# EAGLE schematic AQ_sensor_GSM (EAGLE 9.6.2)

## Sheet 1 of 8: Control Board
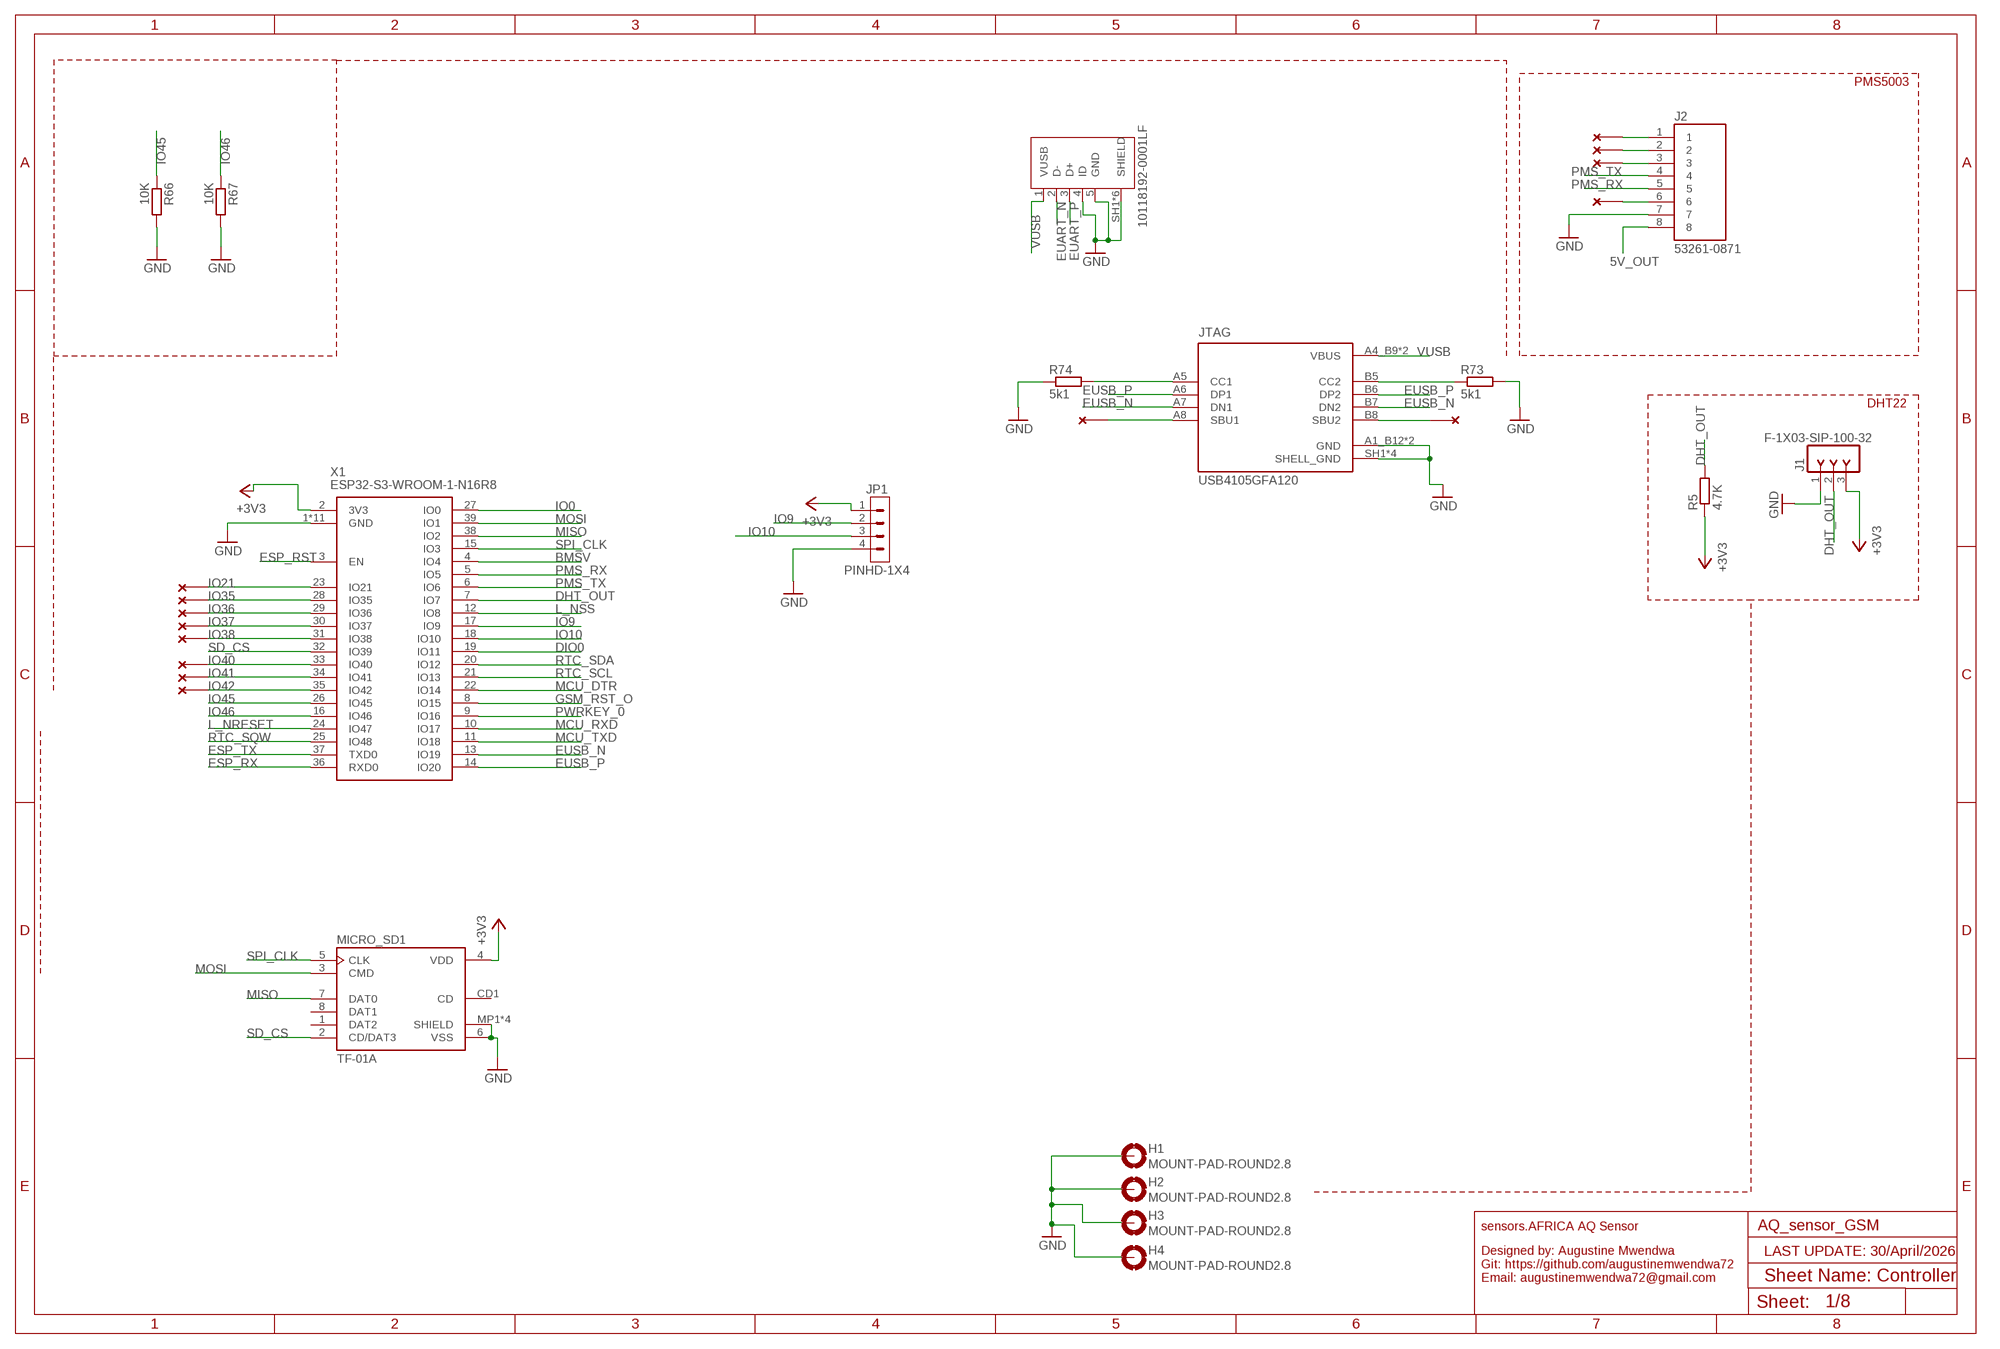
[diagram p0: schematic, sheet 1]

### Parts
ESP_UART  10118192-0001LF  [AMPHENOL_10118192-0001LF]
H1  MOUNT-PAD-ROUND2.8  [2,8-PAD]
H2  MOUNT-PAD-ROUND2.8  [2,8-PAD]
H3  MOUNT-PAD-ROUND2.8  [2,8-PAD]
H4  MOUNT-PAD-ROUND2.8  [2,8-PAD]
J1  F-1X03-SIP-100-32  [SIP-100-03-32]
J2  53261-0871  [MOLEX_53261-0871]
JP1  PINHD-1X4  [1X04]
JTAG  USB4105GFA120  [GCT_USB4105GFA120]
MICRO_SD1  TF-01A  [TF-01A]
R5  4.7K  R-EU_R0603  [R0603]
R66  10K  R-EU_R0603  [R0603]
R67  10K  R-EU_R0603  [R0603]
R73  5k1  R-EU_R0603  [R0603]
R74  5k1  R-EU_R0603  [R0603]
U$87  NC_MARKER  (no package)
U$88  NC_MARKER  (no package)
U$89  NC_MARKER  (no package)
U$90  NC_MARKER  (no package)
U$91  NC_MARKER  (no package)
U$92  NC_MARKER  (no package)
U$93  NC_MARKER  (no package)
U$94  NC_MARKER  (no package)
U$100  NC_MARKER  (no package)
U$101  NC_MARKER  (no package)
U$102  NC_MARKER  (no package)
U$103  NC_MARKER  (no package)
U$104  NC_MARKER  (no package)
U$105  NC_MARKER  (no package)
X1  ESP32-S3-WROOM-1-N16R8  [ESP32S3WROOM1N8R2]

### Nets
5V_OUT [HCurrent]: J2.8 ; also sheet 3,4,6,8
+3V3 [POWER]: J1.3 JP1.1 MICRO_SD1.4(VDD) R5.1 X1.2(3V3) ; also sheet 2,4,6,7
BMSV [HCurrent]: X1.4(IO4) ; also sheet 4
DHT_OUT: J1.2 R5.2 X1.7(IO7)
DIO0: X1.19(IO11) ; also sheet 7
ESP_RST: X1.3(EN) ; also sheet 6
ESP_RX: X1.36(RXD0) ; also sheet 6
ESP_TX: X1.37(TXD0) ; also sheet 6
EUART_N: ESP_UART.2(D-) ; also sheet 6
EUART_P: ESP_UART.3(D+) ; also sheet 6
EUSB_N: JTAG.A7(DN1) JTAG.B7(DN2) X1.13(IO19) ; also sheet 6
EUSB_P: JTAG.A6(DP1) JTAG.B6(DP2) X1.14(IO20) ; also sheet 6
GND: ESP_UART.4(ID) ESP_UART.5(GND) ESP_UART.SH1(SHIELD) ESP_UART.SH2(SHIELD) ESP_UART.SH3(SHIELD) ESP_UART.SH4(SHIELD) ESP_UART.SH5(SHIELD) ESP_UART.SH6(SHIELD) H1.B2,8(MOUNT) H2.B2,8(MOUNT) H3.B2,8(MOUNT) H4.B2,8(MOUNT) J1.1 J2.7 JP1.4 JTAG.A1_B12(GND) JTAG.B1_A12(GND) JTAG.SH1(SHELL_GND) JTAG.SH2(SHELL_GND) JTAG.SH3(SHELL_GND) JTAG.SH4(SHELL_GND) MICRO_SD1.6(VSS) MICRO_SD1.MP1(SHIELD) MICRO_SD1.MP2(SHIELD) MICRO_SD1.MP3(SHIELD) MICRO_SD1.MP4(SHIELD) R66.2 R67.2 R73.2 R74.1 X1.1(GND) X1.40(GND) X1.41(GND) X1.42(GND) X1.43(GND) X1.44(GND) X1.45(GND) X1.46(GND) X1.47(GND) X1.48(GND) X1.49(GND) ; also sheet 2,3,4,5,6,7
GSM_RST_O: X1.8(IO15) ; also sheet 5
IO0: X1.27(IO0) ; also sheet 6
IO9: JP1.2 X1.17(IO9)
IO10: JP1.3 X1.18(IO10)
IO21: U$87.P$1 X1.23(IO21)
IO35: U$88.P$1 X1.28(IO35)
IO36: U$89.P$1 X1.29(IO36)
IO37: U$90.P$1 X1.30(IO37)
IO38: U$91.P$1 X1.31(IO38)
IO40: U$92.P$1 X1.33(IO40)
IO41: U$93.P$1 X1.34(IO41)
IO42: U$94.P$1 X1.35(IO42)
IO45: R66.1 X1.26(IO45)
IO46: R67.1 X1.16(IO46)
L_NRESET: X1.24(IO47) ; also sheet 7
L_NSS: X1.12(IO8) ; also sheet 7
MCU_DTR: X1.22(IO14) ; also sheet 2
MCU_RXD: X1.10(IO17) ; also sheet 2
MCU_TXD: X1.11(IO18) ; also sheet 2
MISO: MICRO_SD1.7(DAT0) X1.38(IO2) ; also sheet 7
MOSI: MICRO_SD1.3(CMD) X1.39(IO1) ; also sheet 7
N$12: JTAG.A5(CC1) R74.2
N$139: JTAG.A8(SBU1) U$100.P$1
N$140: J2.1 U$103.P$1
N$141: JTAG.B8(SBU2) U$101.P$1
N$144: JTAG.B5(CC2) R73.1
N$153: J2.2 U$102.P$1
N$154: J2.3 U$104.P$1
N$155: J2.6 U$105.P$1
PMS_RX: J2.5 X1.5(IO5)
PMS_TX: J2.4 X1.6(IO6)
PWRKEY_0: X1.9(IO16) ; also sheet 5
RTC_SCL: X1.21(IO13) ; also sheet 8
RTC_SDA: X1.20(IO12) ; also sheet 8
RTC_SQW: X1.25(IO48) ; also sheet 8
SD_CS: MICRO_SD1.2(CD/DAT3) X1.32(IO39)
SPI_CLK: MICRO_SD1.5(CLK) X1.15(IO3) ; also sheet 7
VUSB [HCurrent]: ESP_UART.1(VUSB) JTAG.A4_B9(VBUS) JTAG.B4_A9(VBUS) ; also sheet 4,6
Unconnected: MICRO_SD1.1(DAT2) MICRO_SD1.8(DAT1) MICRO_SD1.CD1(CD)

### Notes on the sheet
- PMS5003
- DHT22
- sensors.AFRICA AQ Sensor
- LAST UPDATE: 30/April/2026
- Designed by: Augustine Mwendwa
  Git: https://github.com/augustinemwendwa72
  Email: augustinemwendwa72@gmail.com
- Sheet Name: Controller

## Sheet 2 of 8: Logic Level Converter
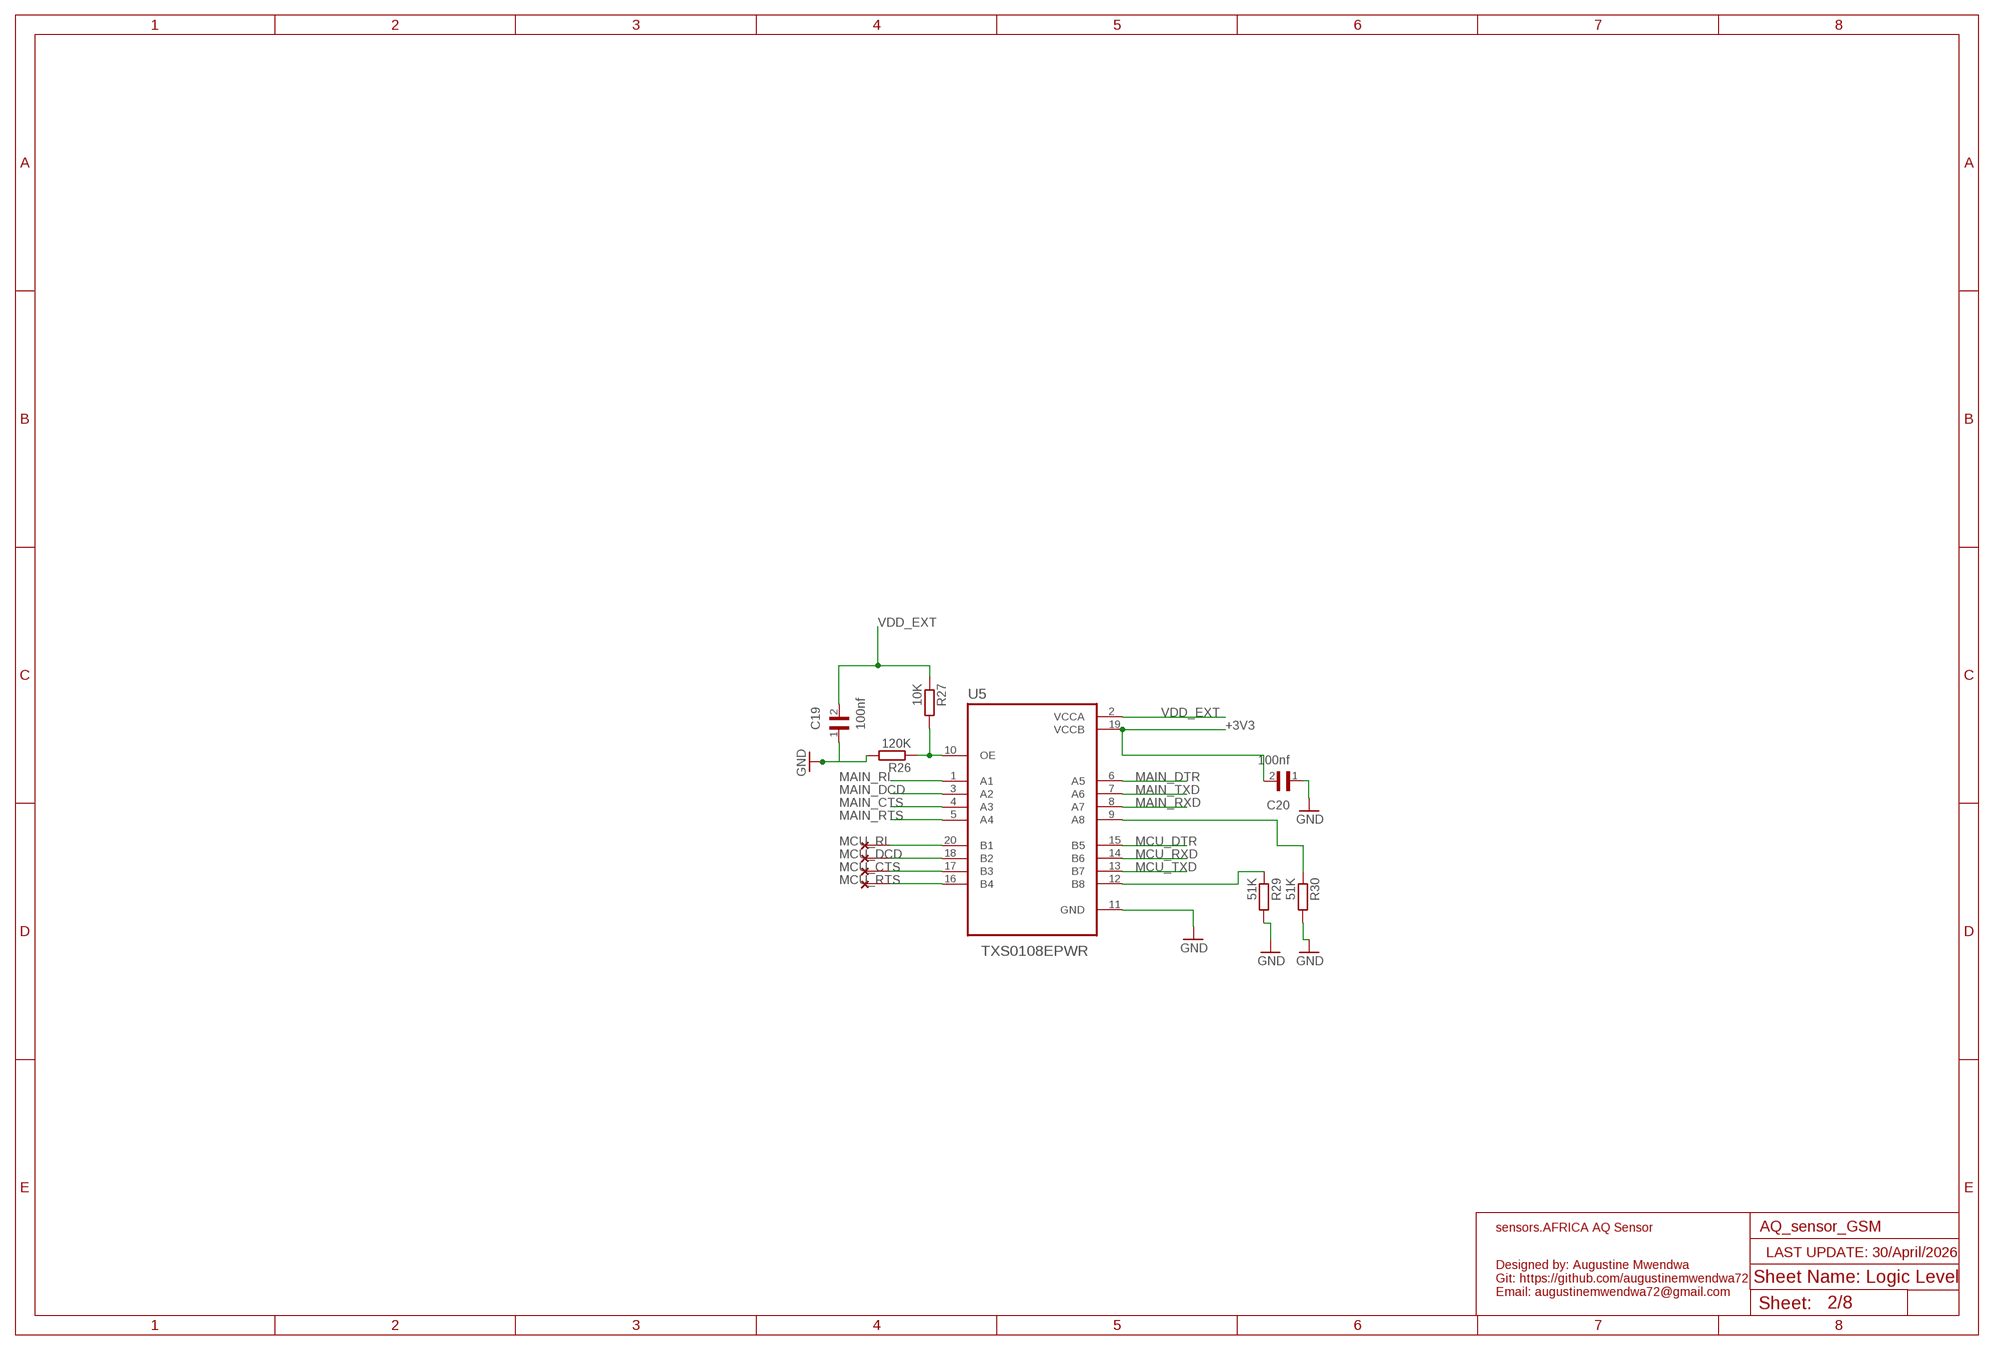
[diagram p1: schematic, sheet 2]

### Parts
C19  100nf  06035C104K4T2A  [CAPC1608X90N]
C20  100nf  06035C104K4T2A  [CAPC1608X90N]
R26  120K  R-EU_R0603  [R0603]
R27  10K  R-EU_R0603  [R0603]
R29  51K  R-EU_R0603  [R0603]
R30  51K  R-EU_R0603  [R0603]
U5  TXS0108EPWR  [SOP65P640X120-20N]
U$85  NC_MARKER  (no package)
U$96  NC_MARKER  (no package)
U$97  NC_MARKER  (no package)
U$98  NC_MARKER  (no package)

### Nets
+3V3 [POWER]: C20.2 U5.19(VCCB) ; also sheet 1,4,6,7
GND: C19.1 C20.1 R26.2 R29.2 R30.2 U5.11(GND) ; also sheet 1,3,4,5,6,7
MAIN_CTS: U5.4(A3) ; also sheet 3
MAIN_DCD: U5.3(A2) ; also sheet 3
MAIN_DTR: U5.6(A5) ; also sheet 3
MAIN_RI [BGA]: U5.1(A1) ; also sheet 3,5
MAIN_RTS: U5.5(A4) ; also sheet 3
MAIN_RXD: U5.8(A7) ; also sheet 3
MAIN_TXD: U5.7(A6) ; also sheet 3
MCU_CTS: U5.17(B3) U$97.P$1
MCU_DCD: U5.18(B2) U$96.P$1
MCU_DTR: U5.15(B5) ; also sheet 1
MCU_RI: U5.20(B1) U$85.P$1
MCU_RTS: U5.16(B4) U$98.P$1
MCU_RXD: U5.14(B6) ; also sheet 1
MCU_TXD: U5.13(B7) ; also sheet 1
N$31: R26.1 R27.2 U5.10(OE)
N$40: R30.1 U5.9(A8)
N$41: R29.1 U5.12(B8)
VDD_EXT: C19.2 R27.1 U5.2(VCCA) ; also sheet 3

### Notes on the sheet
- sensors.AFRICA AQ Sensor
- LAST UPDATE: 30/April/2026
- Sheet Name: Logic Level
- Designed by: Augustine Mwendwa
  Git: https://github.com/augustinemwendwa72
  Email: augustinemwendwa72@gmail.com

## Sheet 3 of 8: GSM
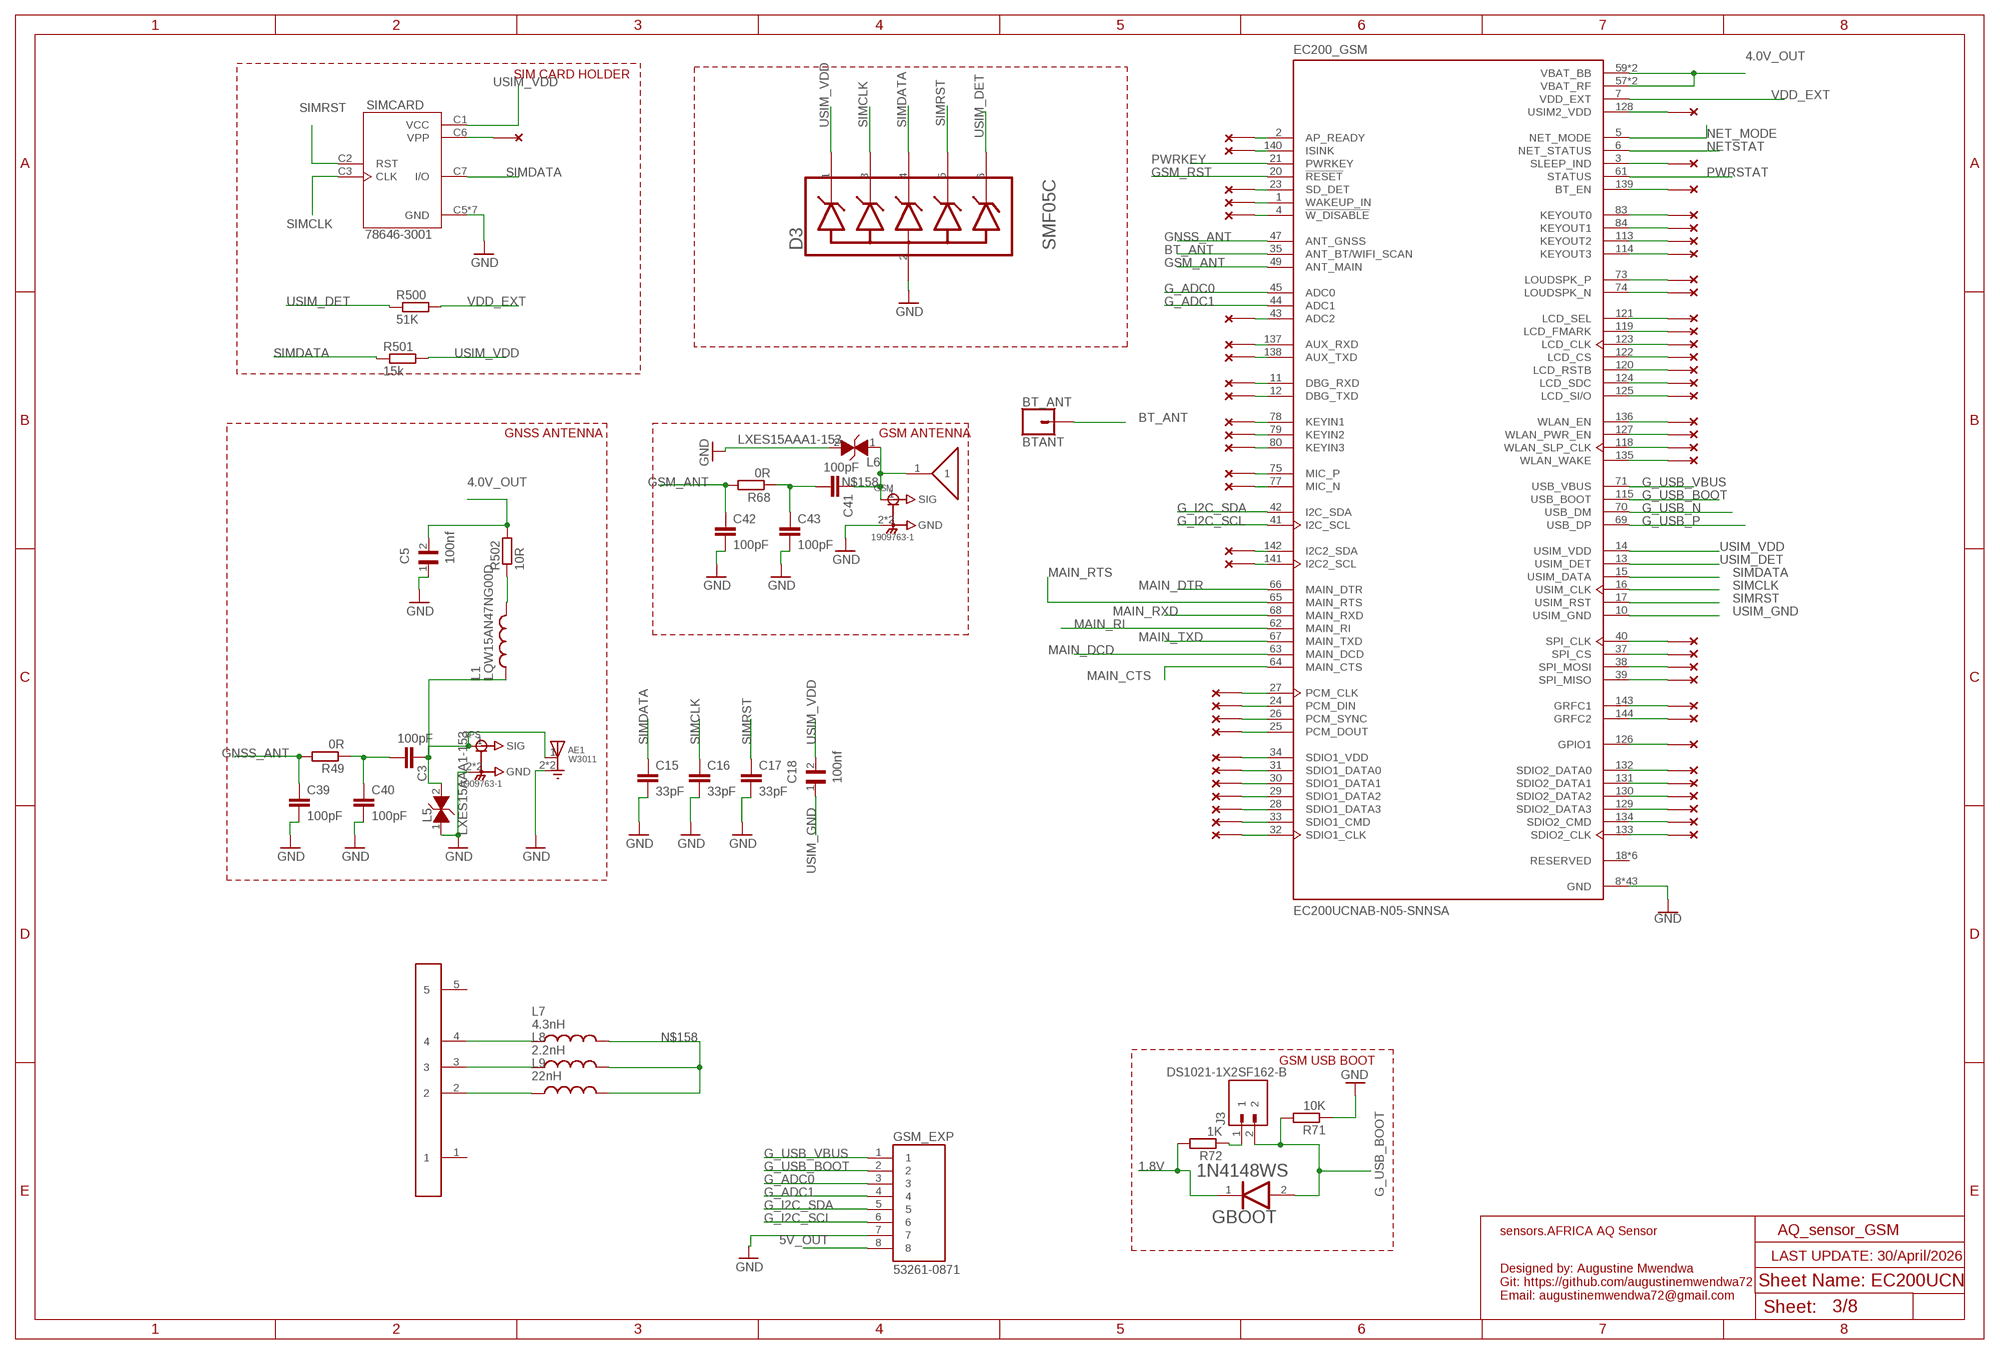
[diagram p2: schematic, sheet 3]

### Parts
AE1  W3011  [XDCR_W3011]
BT_ANT  BTANT  CONN_01  [1X01]
C3  100pF  100PF-0603-50V-5%  [0603]
C5  100nf  06035C104K4T2A  [CAPC1608X90N]
C15  33pF  C-EUC0603  [C0603]
C16  33pF  C-EUC0603  [C0603]
C17  33pF  C-EUC0603  [C0603]
C18  100nf  06035C104K4T2A  [CAPC1608X90N]
C39  100pF  100PF-0603-50V-5%  [0603]
C40  100pF  100PF-0603-50V-5%  [0603]
C41  100pF  100PF-0603-50V-5%  [0603]
C42  100pF  100PF-0603-50V-5%  [0603]
C43  100pF  100PF-0603-50V-5%  [0603]
D3  SEMTECH_SMF05CSEMTECH_SMF05C_0_0  [SEMTECH_SMF05C_0]
EC200_GSM  EC200UCNAB-N05-SNNSA  [XCVR_EC200UCNAB-N05-SNNSA]
GBOOT  ON_SEMI_1N4148WSON_SEMI_1N4148WS_0_0  [ON_SEMI_1N4148WS_0]
GPS  1909763-1  [TE_1909763-1]
GSM  1909763-1  [TE_1909763-1]
GSM_EXP  53261-0871  [MOLEX_53261-0871]
J3  DS1021-1X2SF162-B  [CONNFLY_DS1021-1X2SF162-B]
L1  LQW15AN47NG00D  [INDC1005X60N]
L5  LXES15AAA1-153  [INDC1005X45]
L6  LXES15AAA1-153  [INDC1005X45]
L7  4.3nH  LQW15AN47NG00D  [INDC1005X60N]
L8  2.2nH  LQW15AN47NG00D  [INDC1005X60N]
L9  22nH  LQW15AN47NG00D  [INDC1005X60N]
R49  0R  R-EU_R0603  [R0603]
R68  0R  R-EU_R0603  [R0603]
R71  10K  R-EU_R0603  [R0603]
R72  1K  R-EU_R0603  [R0603]
R500  51K  R-EU_R0603  [R0603]
R501  15k  R-EU_R0603  [R0603]
R502  10R  R-EU_R0603  [R0603]
SIMCARD  78646-3001  [MOLEX_78646-3001]
U$2  NC_MARKER  (no package)
U$3  NC_MARKER  (no package)
U$4  NC_MARKER  (no package)
U$5  NC_MARKER  (no package)
U$6  NC_MARKER  (no package)
U$7  NC_MARKER  (no package)
U$8  NC_MARKER  (no package)
U$9  NC_MARKER  (no package)
U$10  NC_MARKER  (no package)
U$11  NC_MARKER  (no package)
U$12  NC_MARKER  (no package)
U$13  NC_MARKER  (no package)
U$14  NC_MARKER  (no package)
U$15  NC_MARKER  (no package)
U$16  NC_MARKER  (no package)
U$17  NC_MARKER  (no package)
U$18  NC_MARKER  (no package)
U$19  NC_MARKER  (no package)
U$20  NC_MARKER  (no package)
U$21  NC_MARKER  (no package)
U$22  NC_MARKER  (no package)
U$23  NC_MARKER  (no package)
U$24  NC_MARKER  (no package)
U$25  NC_MARKER  (no package)
U$26  NC_MARKER  (no package)
U$27  NC_MARKER  (no package)
U$28  NC_MARKER  (no package)
U$29  NC_MARKER  (no package)
U$30  NC_MARKER  (no package)
U$31  NC_MARKER  (no package)
U$32  NC_MARKER  (no package)
U$33  NC_MARKER  (no package)
U$34  NC_MARKER  (no package)
U$35  NC_MARKER  (no package)
U$36  NC_MARKER  (no package)
U$37  NC_MARKER  (no package)
U$38  NC_MARKER  (no package)
U$39  NC_MARKER  (no package)
U$40  NC_MARKER  (no package)
U$41  NC_MARKER  (no package)
U$42  NC_MARKER  (no package)
U$43  NC_MARKER  (no package)
U$44  NC_MARKER  (no package)
U$45  NC_MARKER  (no package)
U$46  NC_MARKER  (no package)
U$47  NC_MARKER  (no package)
U$48  NC_MARKER  (no package)
U$49  NC_MARKER  (no package)
U$50  NC_MARKER  (no package)
U$51  NC_MARKER  (no package)
U$52  NC_MARKER  (no package)
U$53  NC_MARKER  (no package)
U$54  NC_MARKER  (no package)
U$55  NC_MARKER  (no package)
U$56  NC_MARKER  (no package)
U$57  NC_MARKER  (no package)
U$58  NC_MARKER  (no package)
U$75  NC_MARKER  (no package)
U$81  NC_MARKER  (no package)
U$82  NC_MARKER  (no package)
U$83  NC_MARKER  (no package)
U$84  NC_MARKER  (no package)
U$107  GSM_SPRING_ANTENNA  [GSM_SPRING_ANTENNA]
U$109  ADCH002_V1  [ADCH002_V1]

### Nets
1.8V: GBOOT.1(CATHODE) R72.2 ; also sheet 4
4.0V_OUT [HCurrent]: C5.2 EC200_GSM.57(VBAT_RF) EC200_GSM.58(VBAT_RF) EC200_GSM.59(VBAT_BB) EC200_GSM.60(VBAT_BB) R502.2 ; also sheet 4,5
5V_OUT [HCurrent]: GSM_EXP.8 ; also sheet 1,4,6,8
BT_ANT [Antenna]: BT_ANT.1 EC200_GSM.35(ANT_BT/WIFI_SCAN)
G_ADC0: EC200_GSM.45(ADC0) GSM_EXP.3
G_ADC1: EC200_GSM.44(ADC1) GSM_EXP.4
G_I2C_SCL: EC200_GSM.41(I2C_SCL) GSM_EXP.6
G_I2C_SDA: EC200_GSM.42(I2C_SDA) GSM_EXP.5
G_USB_BOOT: EC200_GSM.115(USB_BOOT) GBOOT.2(ANODE) GSM_EXP.2 J3.2 R71.2
G_USB_N: EC200_GSM.70(USB_DM) ; also sheet 4,6
G_USB_P: EC200_GSM.69(USB_DP) ; also sheet 4,6
G_USB_VBUS: EC200_GSM.71(USB_VBUS) GSM_EXP.1
GND: AE1.2(GND) AE1.3(GND) C5.1 C15.2 C16.2 C17.2 C39.2 C40.2 C42.2 C43.2 D3.2(ANODE) EC200_GSM.8(GND) EC200_GSM.9(GND) EC200_GSM.19(GND) EC200_GSM.22(GND) EC200_GSM.36(GND) EC200_GSM.46(GND) EC200_GSM.48(GND) EC200_GSM.50(GND) EC200_GSM.51(GND) EC200_GSM.52(GND) EC200_GSM.53(GND) EC200_GSM.54(GND) EC200_GSM.56(GND) EC200_GSM.72(GND) EC200_GSM.76(GND) EC200_GSM.85(GND) EC200_GSM.86(GND) EC200_GSM.87(GND) EC200_GSM.88(GND) EC200_GSM.89(GND) EC200_GSM.90(GND) EC200_GSM.91(GND) EC200_GSM.92(GND) EC200_GSM.93(GND) EC200_GSM.94(GND) EC200_GSM.95(GND) EC200_GSM.96(GND) EC200_GSM.97(GND) EC200_GSM.98(GND) EC200_GSM.99(GND) EC200_GSM.100(GND) EC200_GSM.101(GND) EC200_GSM.102(GND) EC200_GSM.103(GND) EC200_GSM.104(GND) EC200_GSM.105(GND) EC200_GSM.106(GND) EC200_GSM.107(GND) EC200_GSM.108(GND) EC200_GSM.109(GND) EC200_GSM.110(GND) EC200_GSM.111(GND) EC200_GSM.112(GND) GPS.2(GND) GPS.3(GND) GSM.2(GND) GSM.3(GND) GSM_EXP.7 L5.1 L6.2 R71.1 SIMCARD.C5(GND) SIMCARD.G1(GND) SIMCARD.G2(GND) SIMCARD.G3(GND) SIMCARD.G4(GND) SIMCARD.G5(GND) SIMCARD.G6(GND) ; also sheet 1,2,4,5,6,7
GNSS_ANT [Antenna]: C39.1 EC200_GSM.47(ANT_GNSS) R49.2
GSM_ANT [Antenna]: C42.1 EC200_GSM.49(ANT_MAIN) R68.2
GSM_RST [BGA]: EC200_GSM.20(!RESET) ; also sheet 5
MAIN_CTS: EC200_GSM.64(MAIN_CTS) ; also sheet 2
MAIN_DCD: EC200_GSM.63(MAIN_DCD) ; also sheet 2
MAIN_DTR: EC200_GSM.66(MAIN_DTR) ; also sheet 2
MAIN_RI [BGA]: EC200_GSM.62(MAIN_RI) ; also sheet 2,5
MAIN_RTS: EC200_GSM.65(MAIN_RTS) ; also sheet 2
MAIN_RXD: EC200_GSM.68(MAIN_RXD) ; also sheet 2
MAIN_TXD: EC200_GSM.67(MAIN_TXD) ; also sheet 2
N$3: L1.2 R502.1
N$5: EC200_GSM.83(KEYOUT0) U$2.P$1
N$7: EC200_GSM.139(BT_EN) U$55.P$1
N$8: EC200_GSM.84(KEYOUT1) U$3.P$1
N$10 [Antenna]: AE1.1(FEED) C3.1 GPS.1(SIG) L1.1 L5.2
N$15: EC200_GSM.113(KEYOUT2) U$4.P$1
N$16: EC200_GSM.114(KEYOUT3) U$5.P$1
N$23: EC200_GSM.73(LOUDSPK_P) U$6.P$1
N$60: EC200_GSM.74(LOUDSPK_N) U$7.P$1
N$64: EC200_GSM.121(LCD_SEL) U$8.P$1
N$65: EC200_GSM.119(LCD_FMARK) U$9.P$1
N$66: EC200_GSM.123(LCD_CLK) U$10.P$1
N$67: EC200_GSM.122(LCD_CS) U$11.P$1
N$68: EC200_GSM.120(LCD_RSTB) U$12.P$1
N$69: EC200_GSM.124(LCD_SDC) U$13.P$1
N$70: EC200_GSM.125(LCD_SI/O) U$14.P$1
N$71: EC200_GSM.136(WLAN_EN) U$15.P$1
N$72: EC200_GSM.127(WLAN_PWR_EN) U$16.P$1
N$73: EC200_GSM.118(WLAN_SLP_CLK) U$17.P$1
N$74: EC200_GSM.135(WLAN_WAKE) U$18.P$1
N$75: EC200_GSM.143(GRFC1) U$19.P$1
N$76: EC200_GSM.144(GRFC2) U$20.P$1
N$77: EC200_GSM.132(SDIO2_DATA0) U$21.P$1
N$78: EC200_GSM.131(SDIO2_DATA1) U$23.P$1
N$79: EC200_GSM.130(SDIO2_DATA2) U$22.P$1
N$80: EC200_GSM.129(SDIO2_DATA3) U$24.P$1
N$81: EC200_GSM.134(SDIO2_CMD) U$25.P$1
N$82: EC200_GSM.133(SDIO2_CLK) U$26.P$1
N$83: EC200_GSM.38(SPI_MOSI) U$27.P$1
N$84: EC200_GSM.32(SDIO1_CLK) U$28.P$1
N$85: EC200_GSM.33(SDIO1_CMD) U$29.P$1
N$86: EC200_GSM.28(SDIO1_DATA3) U$30.P$1
N$87: EC200_GSM.29(SDIO1_DATA2) U$31.P$1
N$88: EC200_GSM.30(SDIO1_DATA1) U$32.P$1
N$89: EC200_GSM.31(SDIO1_DATA0) U$33.P$1
N$90: EC200_GSM.34(SDIO1_VDD) U$34.P$1
N$91: EC200_GSM.25(PCM_DOUT) U$35.P$1
N$92: EC200_GSM.26(PCM_SYNC) U$36.P$1
N$93: EC200_GSM.24(PCM_DIN) U$37.P$1
N$94: EC200_GSM.27(PCM_CLK) U$38.P$1
N$95: EC200_GSM.137(AUX_RXD) U$49.P$1
N$96: EC200_GSM.138(AUX_TXD) U$48.P$1
N$97: EC200_GSM.11(DBG_RXD) U$47.P$1
N$98: EC200_GSM.12(DBG_TXD) U$46.P$1
N$99: EC200_GSM.78(KEYIN1) U$45.P$1
N$100: EC200_GSM.79(KEYIN2) U$44.P$1
N$101: EC200_GSM.80(KEYIN3) U$43.P$1
N$102: EC200_GSM.75(MIC_P) U$42.P$1
N$103: EC200_GSM.77(MIC_N) U$41.P$1
N$104: EC200_GSM.142(I2C2_SDA) U$40.P$1
N$105: EC200_GSM.141(I2C2_SCL) U$39.P$1
N$106: EC200_GSM.4(!W_DISABLE) U$50.P$1
N$107: EC200_GSM.1(WAKEUP_IN) U$51.P$1
N$108: EC200_GSM.23(SD_DET) U$52.P$1
N$109: EC200_GSM.140(ISINK) U$53.P$1
N$110: EC200_GSM.2(AP_READY) U$54.P$1
N$111: EC200_GSM.128(USIM2_VDD) U$57.P$1
N$112: EC200_GSM.3(SLEEP_IND) U$56.P$1
N$113: SIMCARD.C6(VPP) U$58.P$1
N$128: EC200_GSM.126(GPIO1) U$75.P$1
N$134: EC200_GSM.39(SPI_MISO) U$81.P$1
N$135: EC200_GSM.43(ADC2) U$82.P$1
N$136: EC200_GSM.37(SPI_CS) U$84.P$1
N$137: EC200_GSM.40(SPI_CLK) U$83.P$1
N$156 [Antenna]: C3.2 C40.1 R49.1
N$157 [Antenna]: C41.2 C43.1 R68.1
N$158 [Antenna]: C41.1 GSM.1(SIG) L6.1 L7.2 L8.2 L9.2 U$107.1
N$161: L8.1 U$109.3
N$162: L9.1 U$109.2
N$163: L7.1 U$109.4
N$166: J3.1 R72.1
NET_MODE: EC200_GSM.5(NET_MODE) ; also sheet 5
NETSTAT [BGA]: EC200_GSM.6(NET_STATUS) ; also sheet 5
PWRKEY [BGA]: EC200_GSM.21(PWRKEY) ; also sheet 5
PWRSTAT: EC200_GSM.61(STATUS) ; also sheet 5
SIMCLK [BGA]: C16.1 D3.3(2_CATHODE) EC200_GSM.16(USIM_CLK) SIMCARD.C3(CLK)
SIMDATA: C15.1 D3.4(3_CATHODE) EC200_GSM.15(USIM_DATA) R501.1 SIMCARD.C7(I/O)
SIMRST: C17.1 D3.5(4_CATHODE) EC200_GSM.17(USIM_RST) SIMCARD.C2(RST)
USIM_DET: D3.6(5_CATHODE) EC200_GSM.13(USIM_DET) R500.1
USIM_GND: C18.1 EC200_GSM.10(USIM_GND)
USIM_VDD: C18.2 D3.1(1_CATHODE) EC200_GSM.14(USIM_VDD) R501.2 SIMCARD.C1(VCC)
VDD_EXT: EC200_GSM.7(VDD_EXT) R500.2 ; also sheet 2
Unconnected: EC200_GSM.18(RESERVED) EC200_GSM.55(RESERVED) EC200_GSM.81(RESERVED) EC200_GSM.82(RESERVED) EC200_GSM.116(RESERVED) EC200_GSM.117(RESERVED) U$109.1 U$109.5

### Notes on the sheet
- SIM CARD HOLDER
- GNSS ANTENNA | GSM ANTENNA
- GSM USB BOOT
- sensors.AFRICA AQ Sensor
- LAST UPDATE: 30/April/2026
- Sheet Name: EC200UCN
- Designed by: Augustine Mwendwa
  Git: https://github.com/augustinemwendwa72
  Email: augustinemwendwa72@gmail.com

## Sheet 4 of 8: POWER CIRCUIT
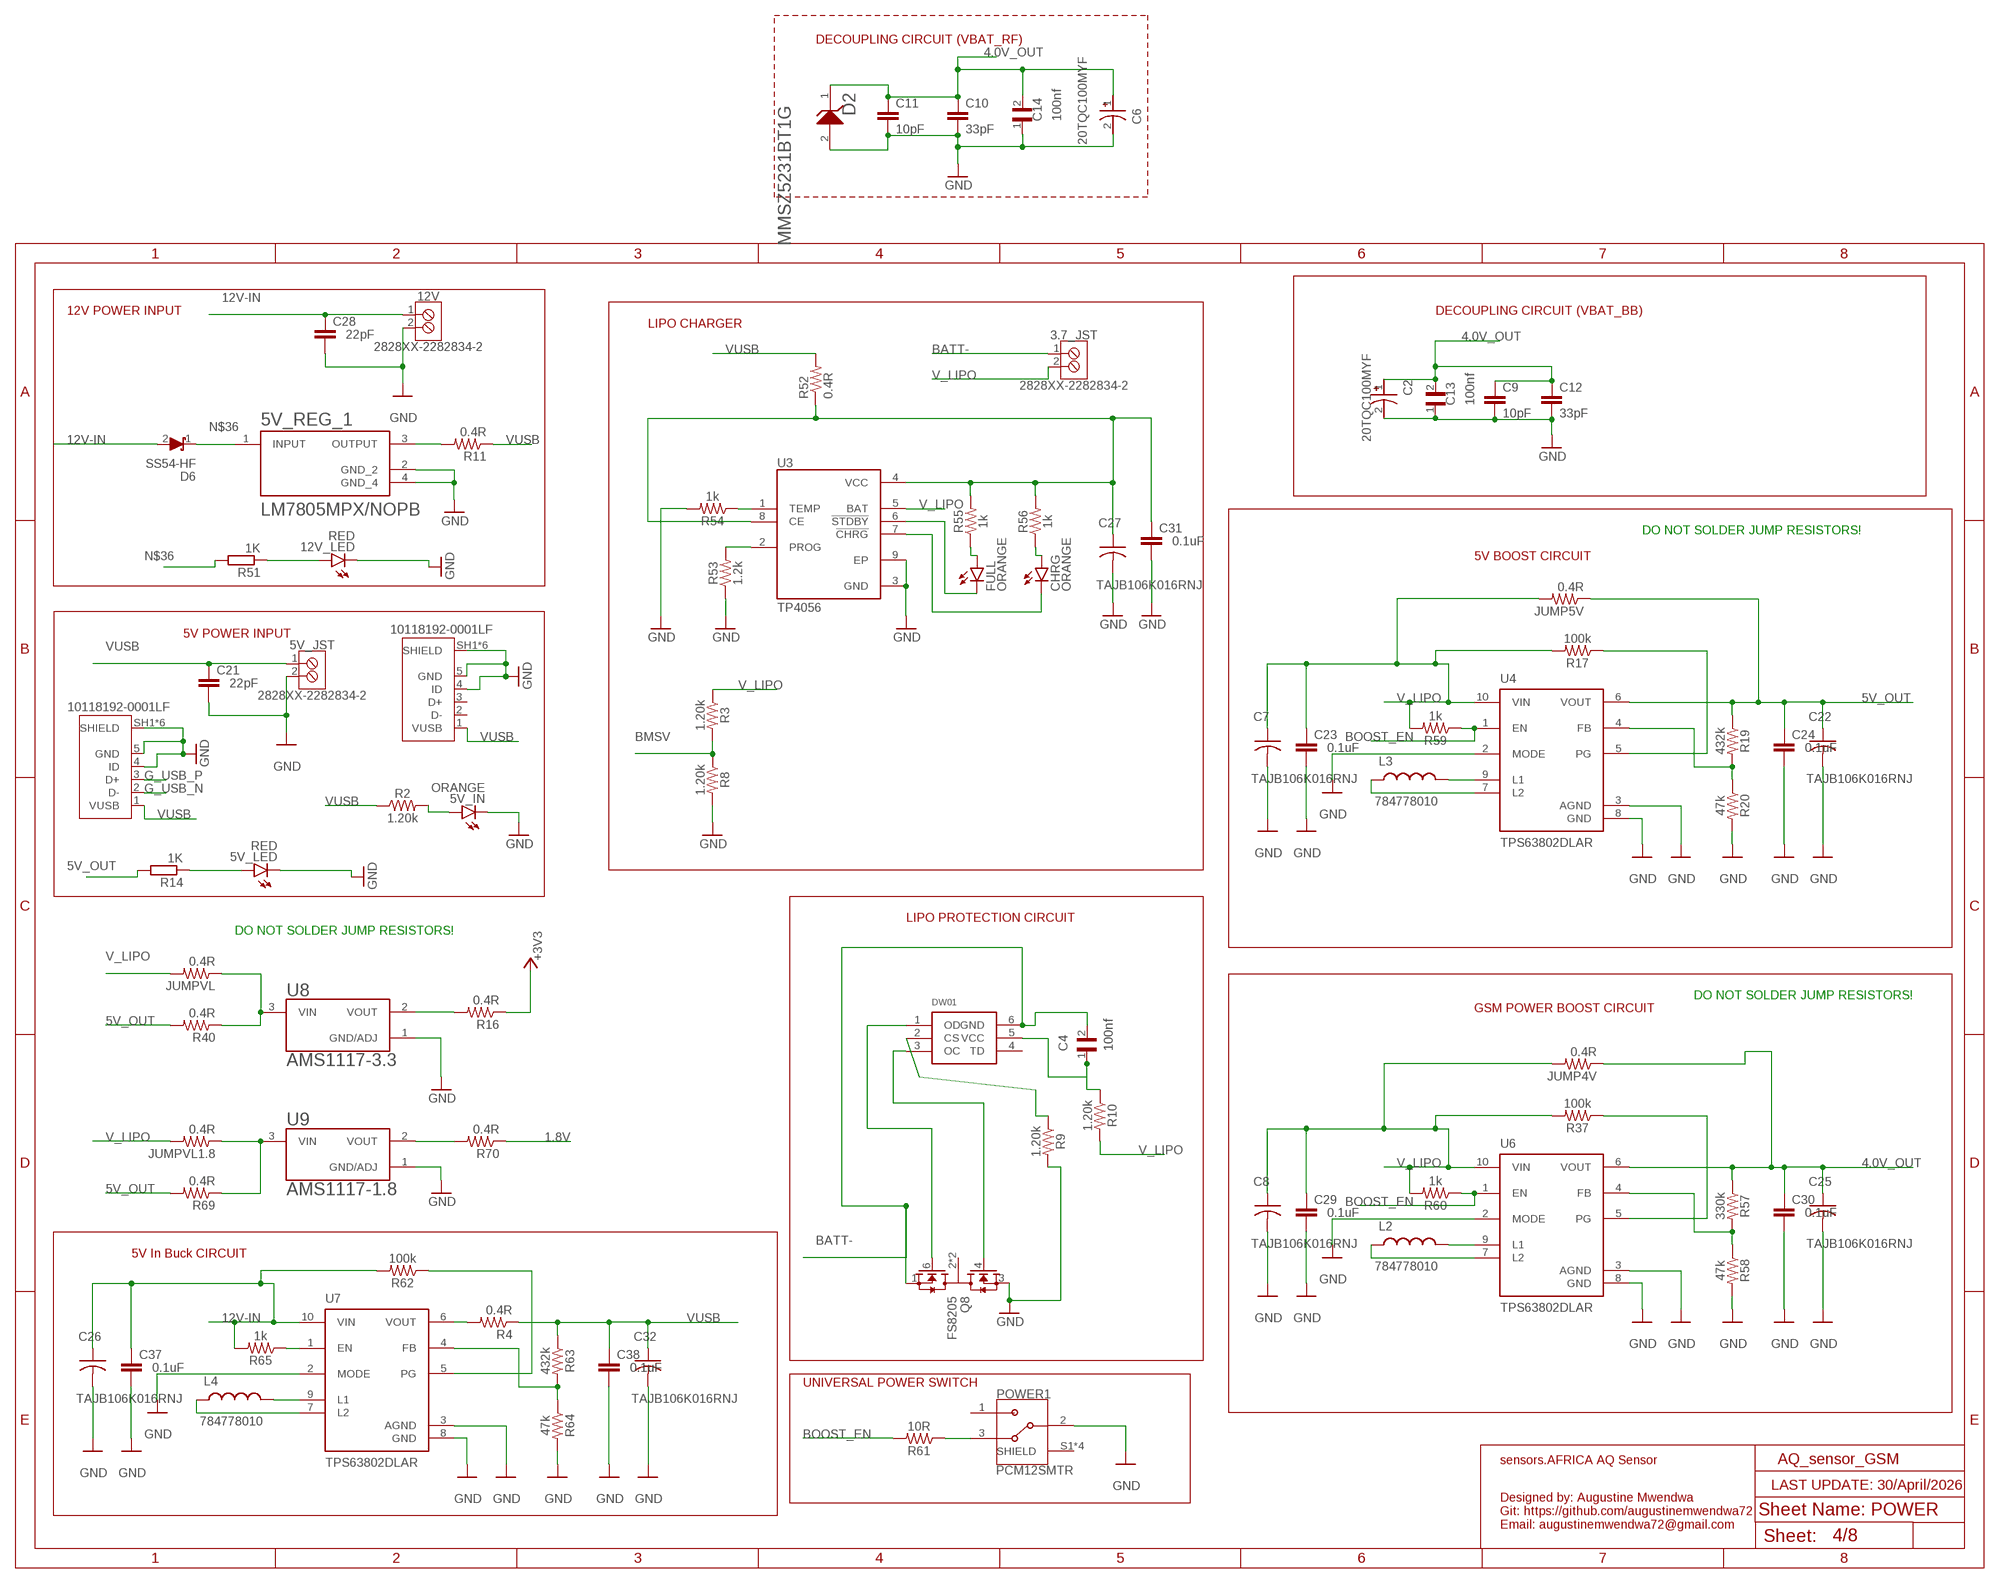
[diagram p3: schematic, sheet 4]

### Parts
3.7_JST  2828XX-2282834-2  [TERMBLK_254-2N]
5V_IN  ORANGE  LEDCHIP-LED0603  [CHIP-LED0603]
5V_JST  2828XX-2282834-2  [TERMBLK_254-2N]
5V_LED  RED  LEDCHIP-LED0603  [CHIP-LED0603]
5V_REG_1  LM7805MPX/NOPB  [VREG_LM7805MPX/NOPB]
12V  2828XX-2282834-2  [TERMBLK_254-2N]
12V_LED  RED  LEDCHIP-LED0603  [CHIP-LED0603]
C2  20TQC100MYF  [CAP_20TQC100MYF]
C4  100nf  06035C104K4T2A  [CAPC1608X90N]
C6  20TQC100MYF  [CAP_20TQC100MYF]
C7  TAJB106K016RNJ  [CAP_TANT_B]
C8  TAJB106K016RNJ  [CAP_TANT_B]
C9  10pF  C-EUC0603  [C0603]
C10  33pF  C-EUC0603  [C0603]
C11  10pF  C-EUC0603  [C0603]
C12  33pF  C-EUC0603  [C0603]
C13  100nf  06035C104K4T2A  [CAPC1608X90N]
C14  100nf  06035C104K4T2A  [CAPC1608X90N]
C21  22pF  C-EUC0603  [C0603]
C22  TAJB106K016RNJ  [CAP_TANT_B]
C23  0.1uF  C-EUC0603  [C0603]
C24  0.1uF  C-EUC0603  [C0603]
C25  TAJB106K016RNJ  [CAP_TANT_B]
C26  TAJB106K016RNJ  [CAP_TANT_B]
C27  TAJB106K016RNJ  [CAP_TANT_B]
C28  22pF  C-EUC0603  [C0603]
C29  0.1uF  C-EUC0603  [C0603]
C30  0.1uF  C-EUC0603  [C0603]
C31  0.1uF  C-EUC0603  [C0603]
C32  TAJB106K016RNJ  [CAP_TANT_B]
C37  0.1uF  C-EUC0603  [C0603]
C38  0.1uF  C-EUC0603  [C0603]
CHRG  ORANGE  LEDCHIP-LED0603  [CHIP-LED0603]
D2  ON_SEMICONDUCTOR_MMSZ5231BT1GON_SEMICONDUCTOR_MMSZ5231BT1G_0_0  [ON_SEMICONDUCTOR_MMSZ5231BT1G_0]
D6  SS54-HF  [DIOM5025X220N]
DW01  DW01-P  [SOT23-6L]
FULL  ORANGE  LEDCHIP-LED0603  [CHIP-LED0603]
JUMP4V  0.4R  CRCW08050000Z0EA  [RES_0805]
JUMP5V  0.4R  CRCW08050000Z0EA  [RES_0805]
JUMPVL  0.4R  CRCW08050000Z0EA  [RES_0805]
JUMPVL1.8  0.4R  CRCW08050000Z0EA  [RES_0805]
L2  784778010  [784778010]
L3  784778010  [784778010]
L4  784778010  [784778010]
POWER  10118192-0001LF  [AMPHENOL_10118192-0001LF]
POWER1  PCM12SMTR  [SW_PCM12SMTR]
Q8  FS8205  [SOT95P280X145-6N]
QUEC_C  10118192-0001LF  [AMPHENOL_10118192-0001LF]
R2  1.20k  1.20KOHM-0603-1/10W-1%  [0603]
R3  1.20k  1.20KOHM-0603-1/10W-1%  [0603]
R4  0.4R  CRCW08050000Z0EA  [RES_0805]
R8  1.20k  1.20KOHM-0603-1/10W-1%  [0603]
R9  1.20k  1.20KOHM-0603-1/10W-1%  [0603]
R10  1.20k  1.20KOHM-0603-1/10W-1%  [0603]
R11  0.4R  CRCW08050000Z0EA  [RES_0805]
R14  1K  R-EU_R0603  [R0603]
R16  0.4R  CRCW08050000Z0EA  [RES_0805]
R17  100k  1.20KOHM-0603-1/10W-1%  [0603]
R19  432k  1.20KOHM-0603-1/10W-1%  [0603]
R20  47k  1.20KOHM-0603-1/10W-1%  [0603]
R37  100k  1.20KOHM-0603-1/10W-1%  [0603]
R40  0.4R  CRCW08050000Z0EA  [RES_0805]
R51  1K  R-EU_R0603  [R0603]
R52  0.4R  CRCW08050000Z0EA  [RES_0805]
R53  1.2k  1.20KOHM-0603-1/10W-1%  [0603]
R54  1k  1.20KOHM-0603-1/10W-1%  [0603]
R55  1k  1.20KOHM-0603-1/10W-1%  [0603]
R56  1k  1.20KOHM-0603-1/10W-1%  [0603]
R57  330k  1.20KOHM-0603-1/10W-1%  [0603]
R58  47k  1.20KOHM-0603-1/10W-1%  [0603]
R59  1k  1.20KOHM-0603-1/10W-1%  [0603]
R60  1k  1.20KOHM-0603-1/10W-1%  [0603]
R61  10R  1.20KOHM-0603-1/10W-1%  [0603]
R62  100k  1.20KOHM-0603-1/10W-1%  [0603]
R63  432k  1.20KOHM-0603-1/10W-1%  [0603]
R64  47k  1.20KOHM-0603-1/10W-1%  [0603]
R65  1k  1.20KOHM-0603-1/10W-1%  [0603]
R69  0.4R  CRCW08050000Z0EA  [RES_0805]
R70  0.4R  CRCW08050000Z0EA  [RES_0805]
U3  TP4056  [SOP127P600X175-9N]
U4  TPS63802DLAR  [VREG_TPS63802DLAR]
U6  TPS63802DLAR  [VREG_TPS63802DLAR]
U7  TPS63802DLAR  [VREG_TPS63802DLAR]
U8  AMS1117-3.3  [SOT229P700X180-4N]
U9  AMS1117-1.8  [SOT229P700X180-4N]

### Nets
1.8V: R70.1 ; also sheet 3
4.0V_OUT [HCurrent]: C2.1 C6.1 C9.1 C10.1 C11.1 C12.1 C13.2 C14.2 C25.1 C30.1 D2.1(K) JUMP4V.1 R57.1 U6.6(VOUT) ; also sheet 3,5
5V_OUT [HCurrent]: C22.1 C24.1 JUMP5V.1 R14.2 R19.1 R40.2 R69.2 U4.6(VOUT) ; also sheet 1,3,6,8
12V-IN [HCurrent]: 12V.1 C26.1 C28.1 C37.1 D6.2(A) R62.2 R65.2 U7.10(VIN)
+3V3 [POWER]: R16.1 ; also sheet 1,2,6,7
BATT- [HCurrent]: 3.7_JST.1 C4.2 DW01.6(GND) Q8.1(S1)
BMSV [HCurrent]: R3.2 R8.1 ; also sheet 1
BOOST_EN: R59.1 R60.1 R61.2 U4.1(EN) U6.1(EN)
G_USB_N: QUEC_C.2(D-) ; also sheet 3,6
G_USB_P: QUEC_C.3(D+) ; also sheet 3,6
GND: 5V_IN.C 5V_JST.2 5V_LED.C 5V_REG_1.2(GND_2) 5V_REG_1.4(GND_4) 12V.2 12V_LED.C C2.2 C6.2 C7.2 C8.2 C9.2 C10.2 C11.2 C12.2 C13.1 C14.1 C21.2 C22.2 C23.2 C24.2 C25.2 C26.2 C27.2 C28.2 C29.2 C30.2 C31.2 C32.2 C37.2 C38.2 D2.2(A) POWER1.2 POWER.4(ID) POWER.5(GND) POWER.SH1(SHIELD) POWER.SH2(SHIELD) POWER.SH3(SHIELD) POWER.SH4(SHIELD) POWER.SH5(SHIELD) POWER.SH6(SHIELD) Q8.3(S2) QUEC_C.4(ID) QUEC_C.5(GND) QUEC_C.SH1(SHIELD) QUEC_C.SH2(SHIELD) QUEC_C.SH3(SHIELD) QUEC_C.SH4(SHIELD) QUEC_C.SH5(SHIELD) QUEC_C.SH6(SHIELD) R8.2 R9.2 R20.2 R53.1 R54.2 R58.2 R64.2 U3.3(GND) U3.9(EP) U4.2(MODE) U4.3(AGND) U4.8(GND) U6.2(MODE) U6.3(AGND) U6.8(GND) U7.2(MODE) U7.3(AGND) U7.8(GND) U8.1(GND/ADJ) U9.1(GND/ADJ) ; also sheet 1,2,3,5,6,7
N$9: DW01.1(OD) Q8.6(G1)
N$11: 5V_IN.A R2.2
N$13: L3.2 U4.9(L1)
N$14: L3.1 U4.7(L2)
N$17: L2.2 U6.9(L1)
N$18: R17.1 U4.5(PG)
N$19 [HCurrent]: DW01.3(OC) Q8.4(G2)
N$20: POWER1.3 R61.1
N$21: R19.2 R20.1 U4.4(FB)
N$24: L2.1 U6.7(L2)
N$25: 5V_LED.A R14.1
N$36 [HCurrent]: 5V_REG_1.1(INPUT) D6.1(K) R51.2
N$37: C4.1 DW01.5(VCC) R10.1
N$45: R37.1 U6.5(PG)
N$46: R57.2 R58.1 U6.4(FB)
N$47: DW01.2(CS) R9.1
N$61: 12V_LED.A R51.1
N$115: R4.2 U7.6(VOUT)
N$116: 5V_REG_1.3(OUTPUT) R11.2
N$117: JUMPVL.1 R40.1 U8.3(VIN)
N$118: R16.2 U8.2(VOUT)
N$138: C27.1 C31.1 R52.1 R55.2 R56.2 U3.4(VCC) U3.8(CE)
N$142: R53.2 U3.2(PROG)
N$143: FULL.A R55.1
N$145: CHRG.A R56.1
N$146: FULL.C U3.6(!STDBY)
N$147: CHRG.C U3.7(!CHRG)
N$148: R54.1 U3.1(TEMP)
N$149: L4.2 U7.9(L1)
N$150: L4.1 U7.7(L2)
N$151: R62.1 U7.5(PG)
N$152: R63.2 R64.1 U7.4(FB)
N$159: R65.1 U7.1(EN)
N$164: JUMPVL1.8.1 R69.1 U9.3(VIN)
N$165: R70.2 U9.2(VOUT)
V_LIPO [HCurrent]: 3.7_JST.2 C7.1 C8.1 C23.1 C29.1 JUMP4V.2 JUMP5V.2 JUMPVL1.8.2 JUMPVL.2 R3.1 R10.2 R17.2 R37.2 R59.2 R60.2 U3.5(BAT) U4.10(VIN) U6.10(VIN)
VUSB [HCurrent]: 5V_JST.1 C21.1 C32.1 C38.1 POWER.1(VUSB) QUEC_C.1(VUSB) R2.1 R4.1 R11.1 R52.2 R63.1 ; also sheet 1,6
Unconnected: DW01.4(TD) POWER1.1 POWER1.S1(SHIELD) POWER1.S2(SHIELD) POWER1.S3(SHIELD) POWER1.S4(SHIELD) POWER.2(D-) POWER.3(D+) Q8.2(D12) Q8.5(D12)

### Notes on the sheet
- DECOUPLING CIRCUIT (VBAT_RF)
- 12V POWER INPUT | DECOUPLING CIRCUIT (VBAT_BB)
- LIPO CHARGER
- DO NOT SOLDER JUMP RESISTORS!
- 5V BOOST CIRCUIT
- 5V POWER INPUT
- LIPO PROTECTION CIRCUIT
- DO NOT SOLDER JUMP RESISTORS!
- DO NOT SOLDER JUMP RESISTORS!
- GSM POWER BOOST CIRCUIT
- 5V In Buck CIRCUIT
- UNIVERSAL POWER SWITCH
- sensors.AFRICA AQ Sensor
- LAST UPDATE: 30/April/2026
- Sheet Name: POWER
- Designed by: Augustine Mwendwa
  Git: https://github.com/augustinemwendwa72
  Email: augustinemwendwa72@gmail.com

## Sheet 5 of 8: LEDs and Buttons
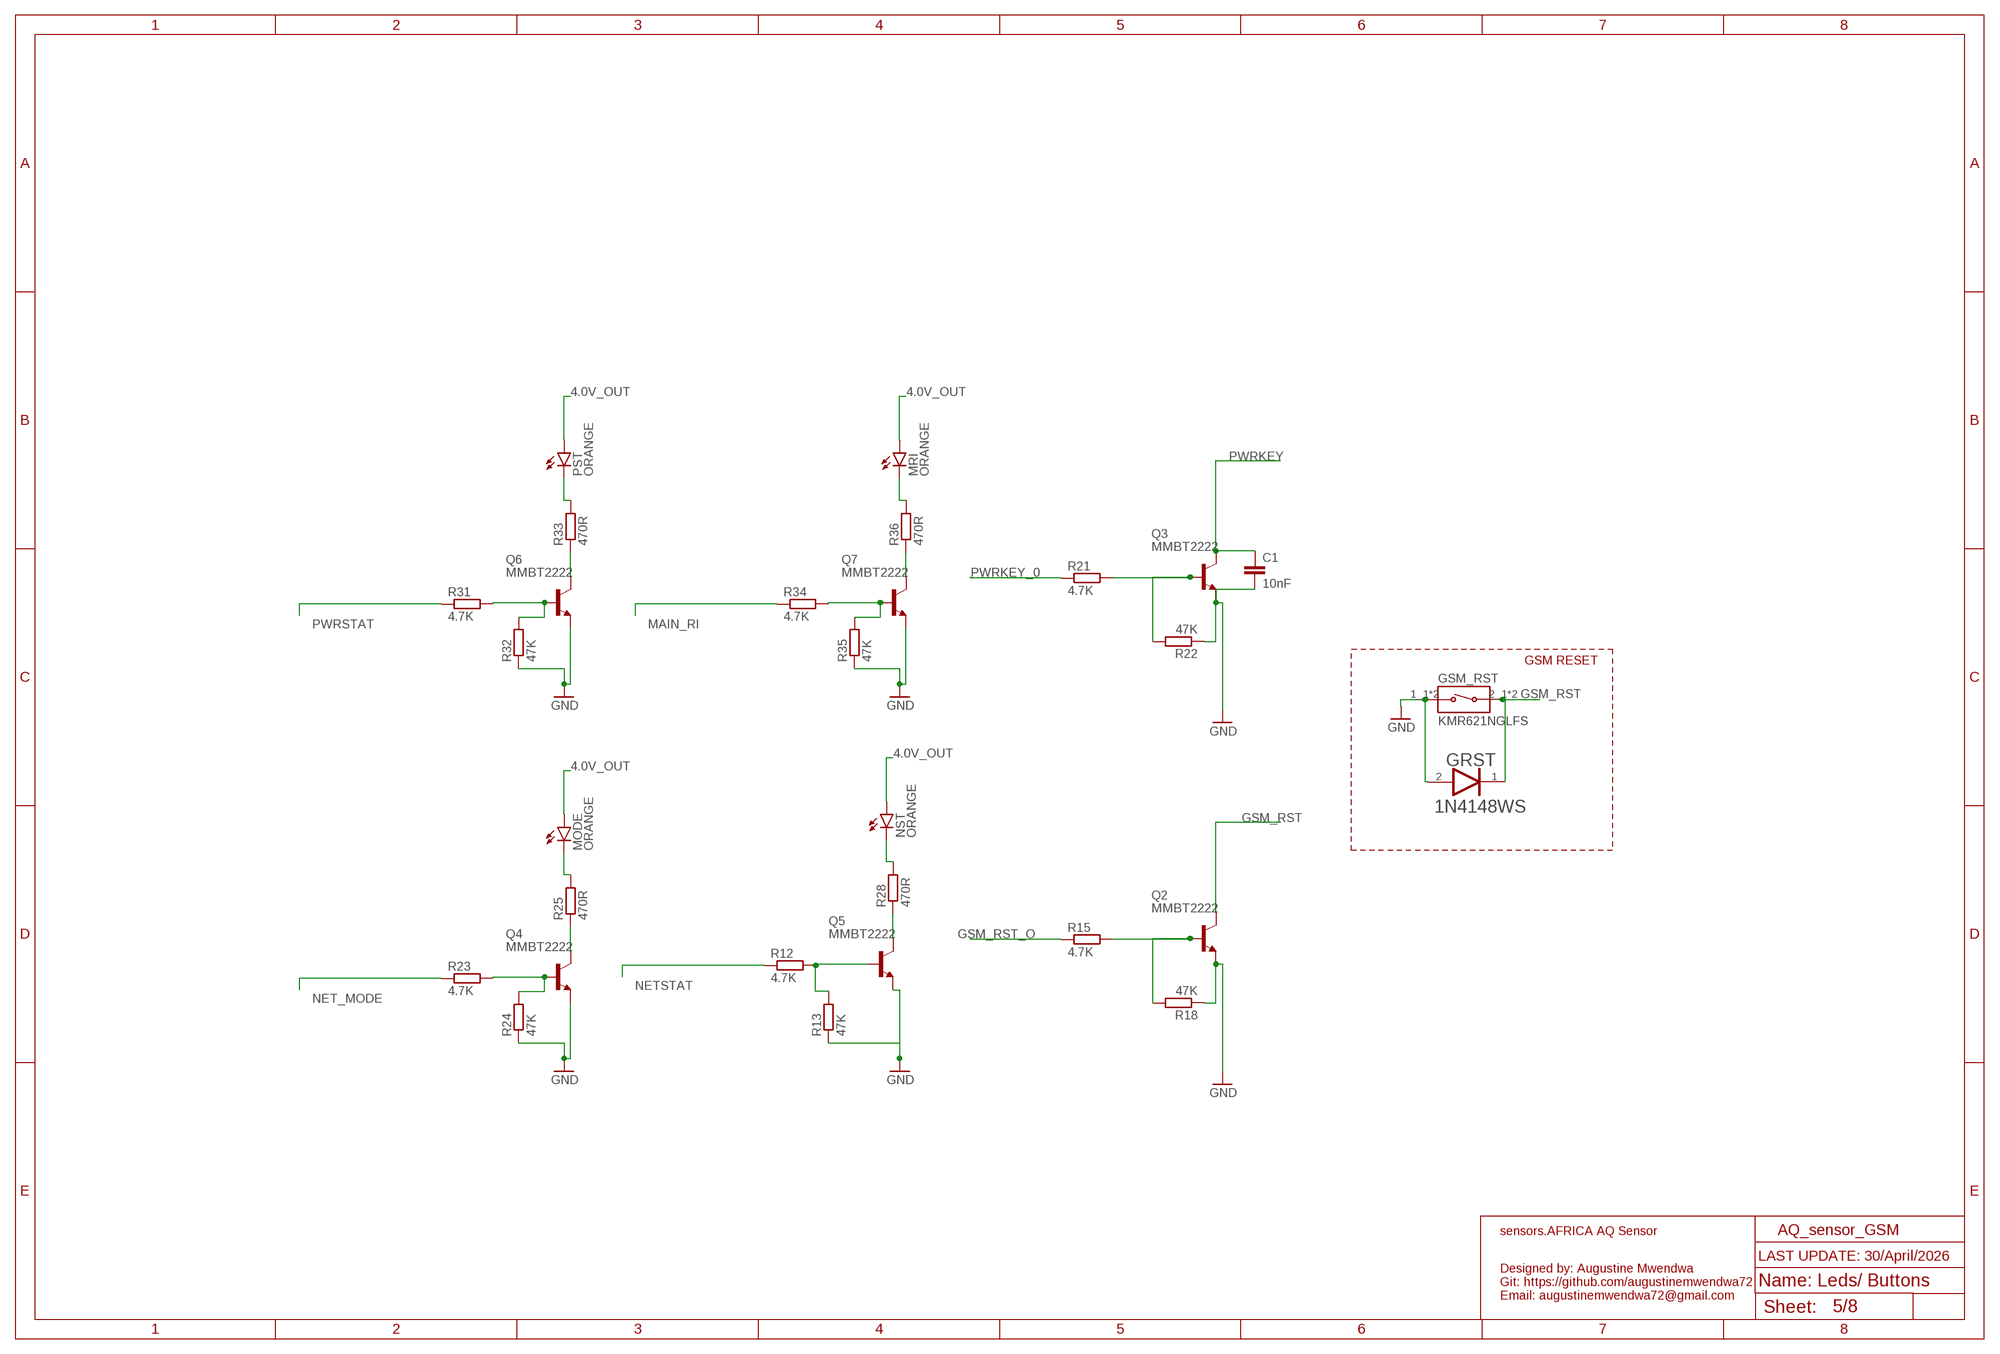
[diagram p4: schematic, sheet 5]

### Parts
C1  10nF  10NF-0603-50V-10%  [0603]
GRST  ON_SEMI_1N4148WSON_SEMI_1N4148WS_0_0  [ON_SEMI_1N4148WS_0]
GSM_RST  KMR621NGLFS  [SW_KMR621NGLFS]
MODE  ORANGE  LEDCHIP-LED0603  [CHIP-LED0603]
MRI  ORANGE  LEDCHIP-LED0603  [CHIP-LED0603]
NST  ORANGE  LEDCHIP-LED0603  [CHIP-LED0603]
PST  ORANGE  LEDCHIP-LED0603  [CHIP-LED0603]
Q2  MMBT2222  [SOT23-BEC]
Q3  MMBT2222  [SOT23-BEC]
Q4  MMBT2222  [SOT23-BEC]
Q5  MMBT2222  [SOT23-BEC]
Q6  MMBT2222  [SOT23-BEC]
Q7  MMBT2222  [SOT23-BEC]
R12  4.7K  R-EU_R0603  [R0603]
R13  47K  R-EU_R0603  [R0603]
R15  4.7K  R-EU_R0603  [R0603]
R18  47K  R-EU_R0603  [R0603]
R21  4.7K  R-EU_R0603  [R0603]
R22  47K  R-EU_R0603  [R0603]
R23  4.7K  R-EU_R0603  [R0603]
R24  47K  R-EU_R0603  [R0603]
R25  470R  R-EU_R0603  [R0603]
R28  470R  R-EU_R0603  [R0603]
R31  4.7K  R-EU_R0603  [R0603]
R32  47K  R-EU_R0603  [R0603]
R33  470R  R-EU_R0603  [R0603]
R34  4.7K  R-EU_R0603  [R0603]
R35  47K  R-EU_R0603  [R0603]
R36  470R  R-EU_R0603  [R0603]

### Nets
4.0V_OUT [HCurrent]: MODE.A MRI.A NST.A PST.A ; also sheet 3,4
GND: C1.2 GRST.2(ANODE) GSM_RST.1_1 GSM_RST.1_2 Q2.E Q3.E Q4.E Q5.E Q6.E Q7.E R13.1 R18.1 R22.1 R24.1 R32.1 R35.1 ; also sheet 1,2,3,4,6,7
GSM_RST [BGA]: GRST.1(CATHODE) GSM_RST.2_1 GSM_RST.2_2 Q2.C ; also sheet 3
GSM_RST_O: R15.1 ; also sheet 1
MAIN_RI [BGA]: R34.1 ; also sheet 2,3
N$1: Q2.B R15.2 R18.2
N$2: Q3.B R21.2 R22.2
N$22: Q5.B R12.2 R13.2
N$26: Q4.B R23.2 R24.2
N$28: Q6.B R31.2 R32.2
N$29: Q4.C R25.1
N$30: MODE.C R25.2
N$32: Q6.C R33.1
N$33: Q5.C R28.1
N$34: NST.C R28.2
N$39: PST.C R33.2
N$42: Q7.B R34.2 R35.2
N$43: Q7.C R36.1
N$44: MRI.C R36.2
NET_MODE: R23.1 ; also sheet 3
NETSTAT [BGA]: R12.1 ; also sheet 3
PWRKEY [BGA]: C1.1 Q3.C ; also sheet 3
PWRKEY_0: R21.1 ; also sheet 1
PWRSTAT: R31.1 ; also sheet 3

### Notes on the sheet
- GSM RESET
- sensors.AFRICA AQ Sensor
- LAST UPDATE: 30/April/2026
- Name: Leds/ Buttons
- Designed by: Augustine Mwendwa
  Git: https://github.com/augustinemwendwa72
  Email: augustinemwendwa72@gmail.com

## Sheet 6 of 8: Protection
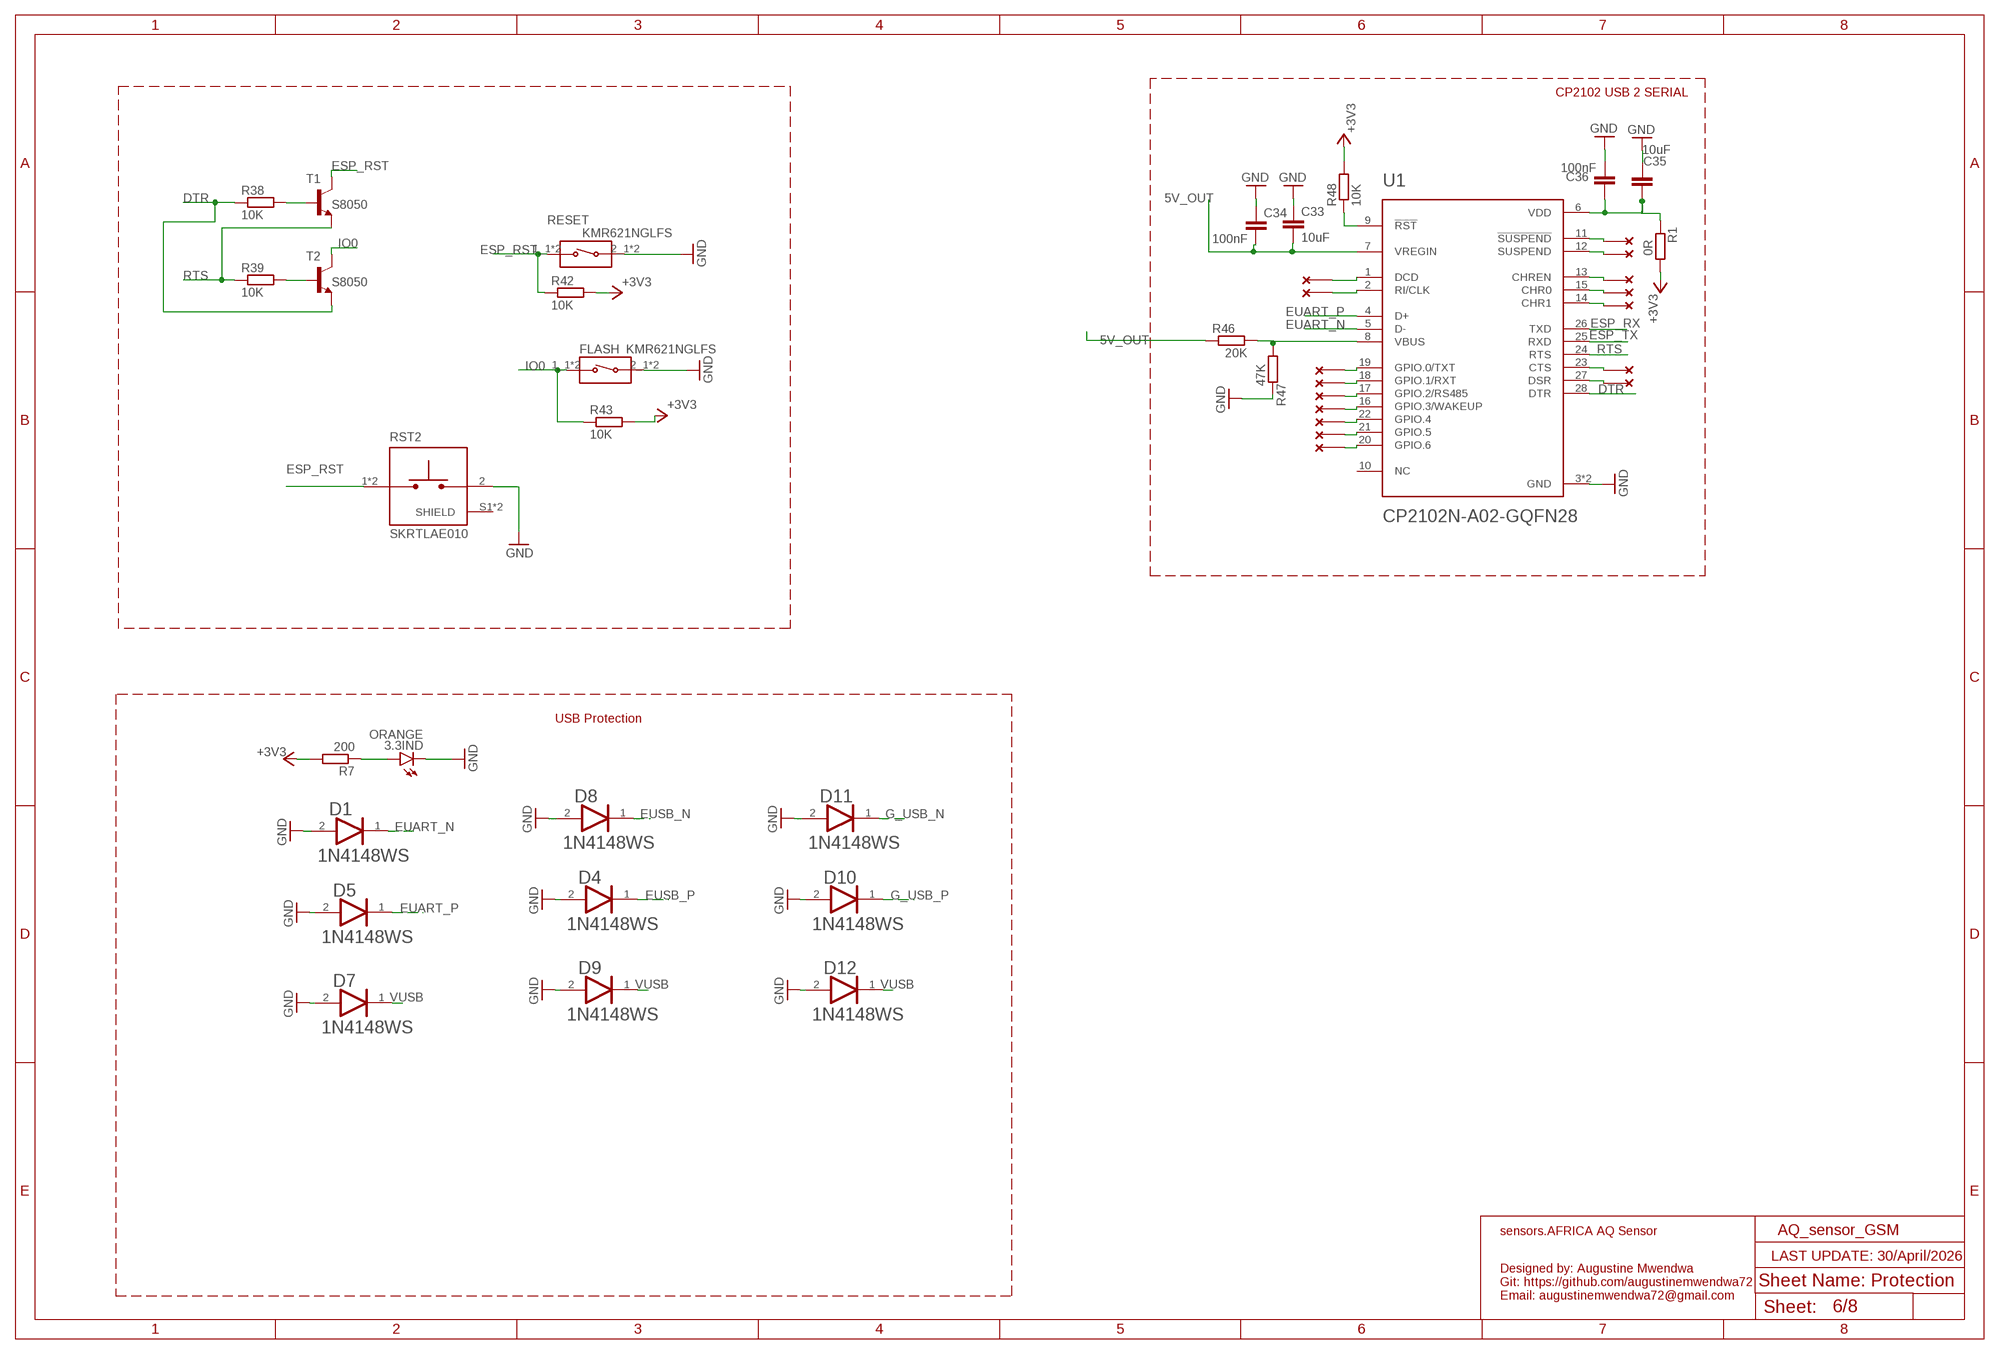
[diagram p5: schematic, sheet 6]

### Parts
3.3IND  ORANGE  LEDCHIP-LED0603  [CHIP-LED0603]
C33  10uF  C-EUC0603  [C0603]
C34  100nF  C-EUC0805  [C0805]
C35  10uF  C-EUC0603  [C0603]
C36  100nF  C-EUC0805  [C0805]
D1  ON_SEMI_1N4148WSON_SEMI_1N4148WS_0_0  [ON_SEMI_1N4148WS_0]
D4  ON_SEMI_1N4148WSON_SEMI_1N4148WS_0_0  [ON_SEMI_1N4148WS_0]
D5  ON_SEMI_1N4148WSON_SEMI_1N4148WS_0_0  [ON_SEMI_1N4148WS_0]
D7  ON_SEMI_1N4148WSON_SEMI_1N4148WS_0_0  [ON_SEMI_1N4148WS_0]
D8  ON_SEMI_1N4148WSON_SEMI_1N4148WS_0_0  [ON_SEMI_1N4148WS_0]
D9  ON_SEMI_1N4148WSON_SEMI_1N4148WS_0_0  [ON_SEMI_1N4148WS_0]
D10  ON_SEMI_1N4148WSON_SEMI_1N4148WS_0_0  [ON_SEMI_1N4148WS_0]
D11  ON_SEMI_1N4148WSON_SEMI_1N4148WS_0_0  [ON_SEMI_1N4148WS_0]
D12  ON_SEMI_1N4148WSON_SEMI_1N4148WS_0_0  [ON_SEMI_1N4148WS_0]
FLASH  KMR621NGLFS  [SW_KMR621NGLFS]
R1  0R  R-EU_R0603  [R0603]
R7  200  R-EU_R0603  [R0603]
R38  10K  R-EU_R0603  [R0603]
R39  10K  R-EU_R0603  [R0603]
R42  10K  R-EU_R0603  [R0603]
R43  10K  R-EU_R0603  [R0603]
R46  20K  R-EU_R0603  [R0603]
R47  47K  R-EU_R0603  [R0603]
R48  10K  R-EU_R0603  [R0603]
RESET  KMR621NGLFS  [SW_KMR621NGLFS]
RST2  SKRTLAE010  [SW_SKRTLAE010]
T1  S8050  MMUN2214LT1-NPN-SC59-BEC  [SC59-BEC]
T2  S8050  MMUN2214LT1-NPN-SC59-BEC  [SC59-BEC]
U1  CP2102N-A02-GQFN28  [QFN50P500X500X80-29N]
U$59  NC_MARKER  (no package)
U$60  NC_MARKER  (no package)
U$61  NC_MARKER  (no package)
U$62  NC_MARKER  (no package)
U$63  NC_MARKER  (no package)
U$64  NC_MARKER  (no package)
U$65  NC_MARKER  (no package)
U$66  NC_MARKER  (no package)
U$67  NC_MARKER  (no package)
U$68  NC_MARKER  (no package)
U$69  NC_MARKER  (no package)
U$70  NC_MARKER  (no package)
U$71  NC_MARKER  (no package)
U$72  NC_MARKER  (no package)
U$73  NC_MARKER  (no package)
U$74  NC_MARKER  (no package)

### Nets
5V_OUT [HCurrent]: C33.2 C34.2 R46.1 U1.7(VREGIN) ; also sheet 1,3,4,8
+3V3 [POWER]: R1.2 R7.2 R42.2 R43.2 R48.2 ; also sheet 1,2,4,7
DTR: R38.1 T2.E U1.28(DTR)
ESP_RST: R42.1 RESET.1_1 RESET.1_2 RST2.1 RST2.3 T1.C ; also sheet 1
ESP_RX: U1.26(TXD) ; also sheet 1
ESP_TX: U1.25(RXD) ; also sheet 1
EUART_N: D1.1(CATHODE) U1.5(D-) ; also sheet 1
EUART_P: D5.1(CATHODE) U1.4(D+) ; also sheet 1
EUSB_N: D8.1(CATHODE) ; also sheet 1
EUSB_P: D4.1(CATHODE) ; also sheet 1
G_USB_N: D11.1(CATHODE) ; also sheet 3,4
G_USB_P: D10.1(CATHODE) ; also sheet 3,4
GND: 3.3IND.C C33.1 C34.1 C35.1 C36.1 D1.2(ANODE) D4.2(ANODE) D5.2(ANODE) D7.2(ANODE) D8.2(ANODE) D9.2(ANODE) D10.2(ANODE) D11.2(ANODE) D12.2(ANODE) FLASH.2_1 FLASH.2_2 R47.2 RESET.2_1 RESET.2_2 RST2.2 U1.3(GND) U1.29(GND) ; also sheet 1,2,3,4,5,7
IO0: FLASH.1_1 FLASH.1_2 R43.1 T2.C ; also sheet 1
N$4: U1.19(GPIO.0/TXT) U$72.P$1
N$27: U1.18(GPIO.1/RXT) U$70.P$1
N$38: 3.3IND.A R7.1
N$48: R38.2 T1.B
N$49: R39.2 T2.B
N$52: R48.1 U1.9(!RST)
N$53: R46.2 R47.1 U1.8(VBUS)
N$54: U1.17(GPIO.2/RS485) U$69.P$1
N$55: U1.16(GPIO.3/WAKEUP) U$68.P$1
N$56: U1.22(GPIO.4) U$67.P$1
N$57: U1.21(GPIO.5) U$66.P$1
N$62 [POWER]: C35.2 C36.2 R1.1 U1.6(VDD)
N$114: U1.20(GPIO.6) U$71.P$1
N$119: U1.27(DSR) U$65.P$1
N$120: U1.23(CTS) U$64.P$1
N$121: U1.14(CHR1) U$63.P$1
N$122: U1.15(CHR0) U$62.P$1
N$123: U1.13(CHREN) U$61.P$1
N$124: U1.12(SUSPEND) U$60.P$1
N$125: U1.11(!SUSPEND) U$59.P$1
N$126: U1.2(RI/CLK) U$73.P$1
N$127: U1.1(DCD) U$74.P$1
RTS: R39.1 T1.E U1.24(RTS)
VUSB [HCurrent]: D7.1(CATHODE) D9.1(CATHODE) D12.1(CATHODE) ; also sheet 1,4
Unconnected: RST2.S1(SHIELD) RST2.S2(SHIELD) U1.10(NC)

### Notes on the sheet
- CP2102 USB 2 SERIAL
- USB Protection
- sensors.AFRICA AQ Sensor
- LAST UPDATE: 30/April/2026
- Sheet Name: Protection
- Designed by: Augustine Mwendwa
  Git: https://github.com/augustinemwendwa72
  Email: augustinemwendwa72@gmail.com

## Sheet 7 of 8: LORA
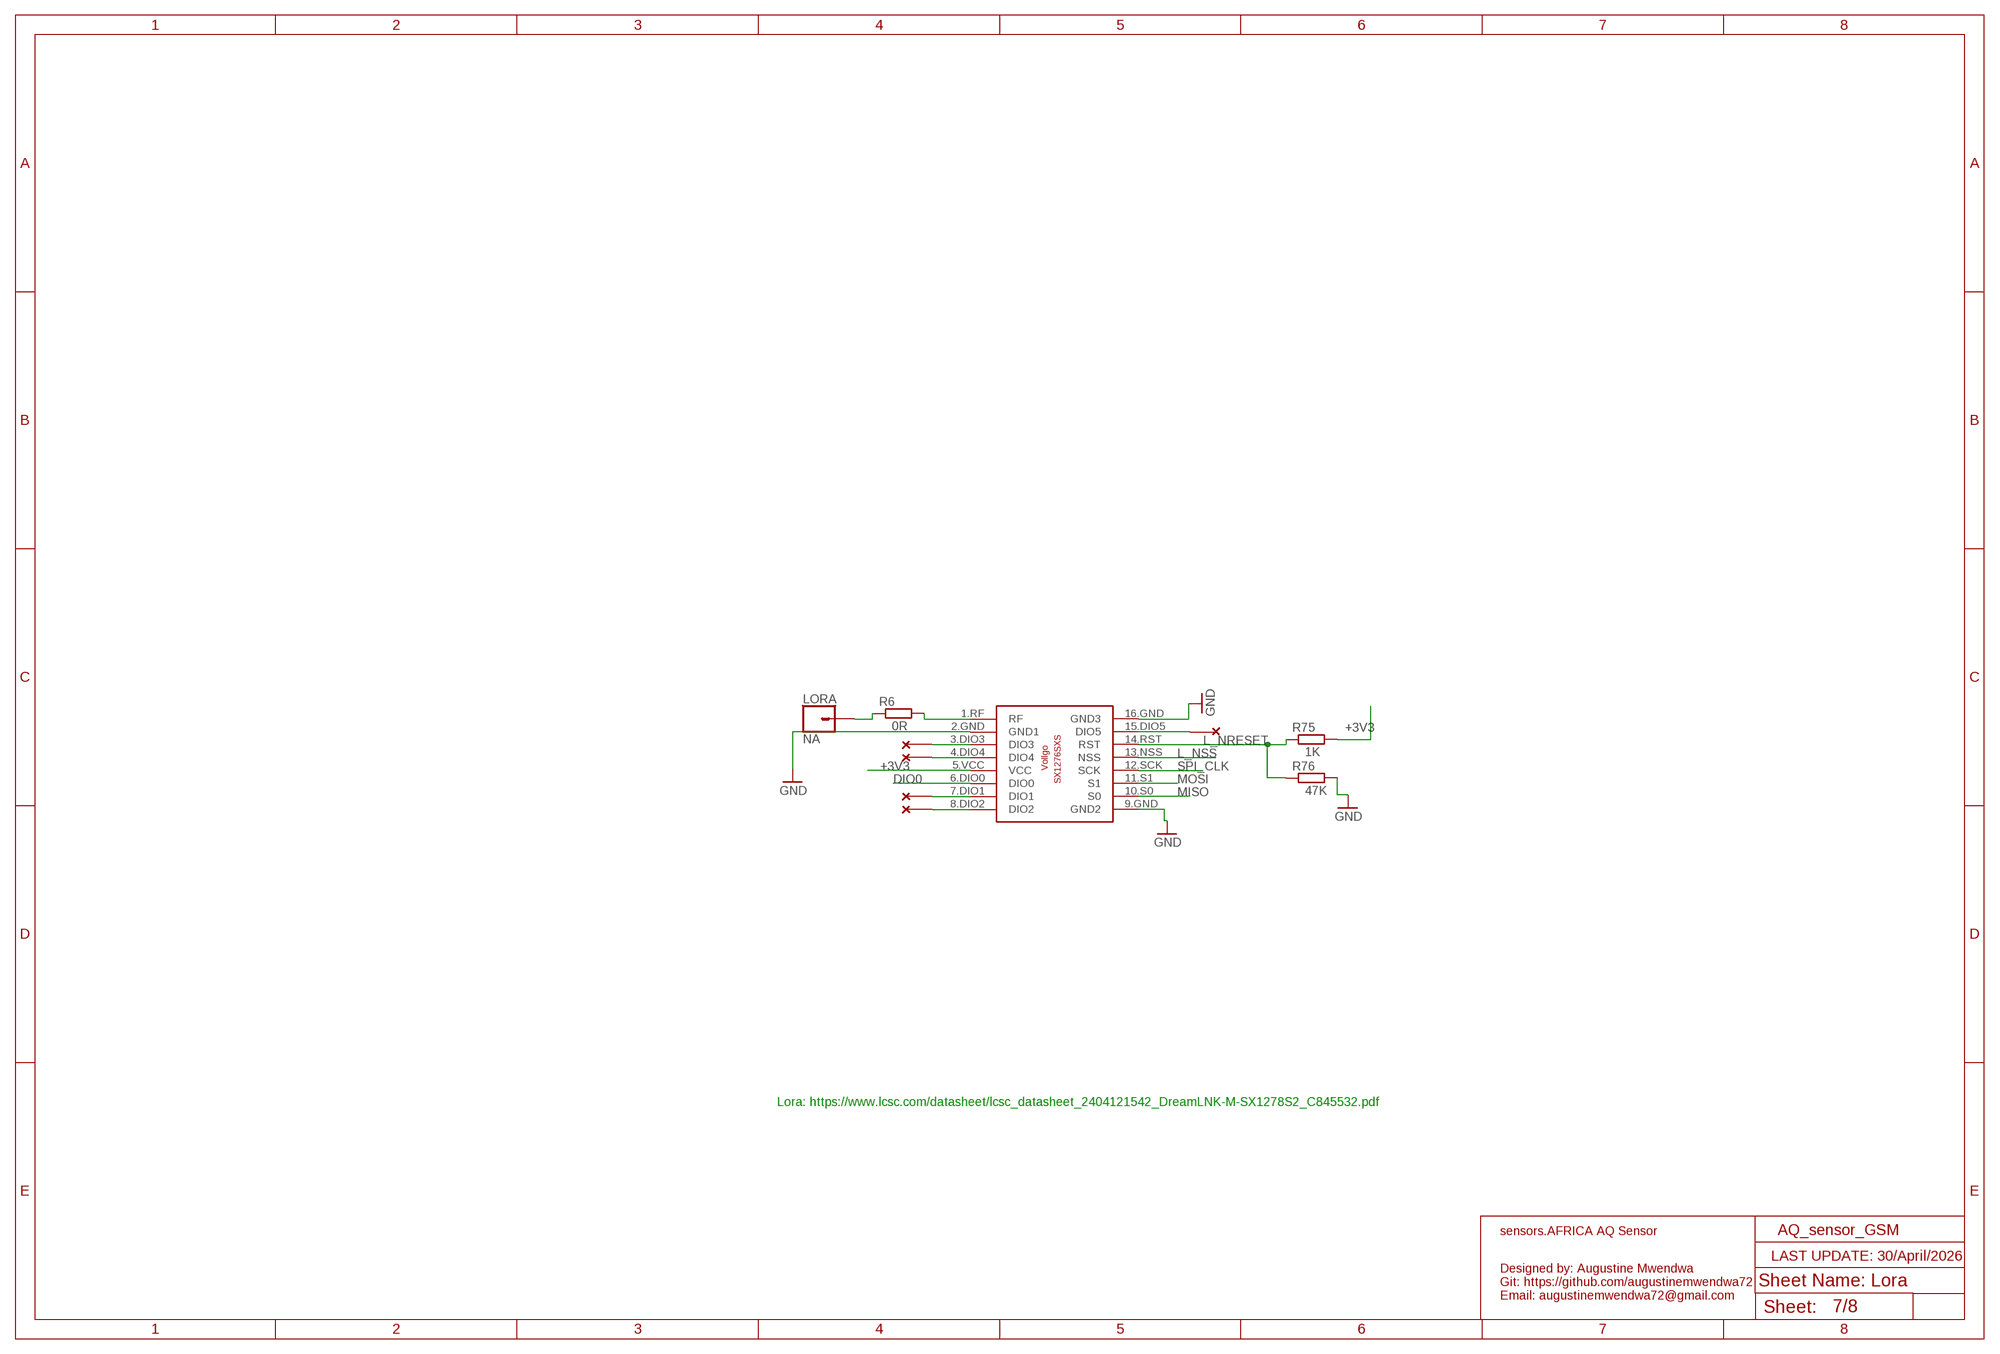
[diagram p6: schematic, sheet 7]

### Parts
LORA  NA  CONN_01  [1X01]
R6  0R  R-EU_R0603  [R0603]
R75  1K  R-EU_R0603  [R0603]
R76  47K  R-EU_R0603  [R0603]
U$86  SX1276SXS  [SX1276SXS]
U$95  NC_MARKER  (no package)
U$99  NC_MARKER  (no package)
U$106  NC_MARKER  (no package)
U$108  NC_MARKER  (no package)
U$112  NC_MARKER  (no package)

### Nets
+3V3 [POWER]: R75.2 U$86.5.VCC(VCC) ; also sheet 1,2,4,6
DIO0: U$86.6.DIO0(DIO0) ; also sheet 1
GND: R76.2 U$86.2.GND(GND1) U$86.9.GND(GND2) U$86.16.GND(GND3) ; also sheet 1,2,3,4,5,6
L_NRESET: R75.1 R76.1 U$86.14.RST(RST) ; also sheet 1
L_NSS: U$86.13.NSS(NSS) ; also sheet 1
MISO: U$86.10.S0(S0) ; also sheet 1
MOSI: U$86.11.S1(S1) ; also sheet 1
N$6: LORA.1 R6.1
N$160: U$86.3.DIO3(DIO3) U$95.P$1
N$167: U$86.4.DIO4(DIO4) U$99.P$1
N$168: U$86.8.DIO2(DIO2) U$108.P$1
N$174: U$86.15.DIO5(DIO5) U$112.P$1
N$175: U$86.7.DIO1(DIO1) U$106.P$1
N$176: R6.2 U$86.1.RF(RF)
SPI_CLK: U$86.12.SCK(SCK) ; also sheet 1

### Notes on the sheet
- Lora: https://www.lcsc.com/datasheet/lcsc_datasheet_2404121542_DreamLNK-M-SX1278S2_C845532.pdf
- sensors.AFRICA AQ Sensor
- LAST UPDATE: 30/April/2026
- Sheet Name: Lora
- Designed by: Augustine Mwendwa
  Git: https://github.com/augustinemwendwa72
  Email: augustinemwendwa72@gmail.com

## Sheet 8 of 8: Clock
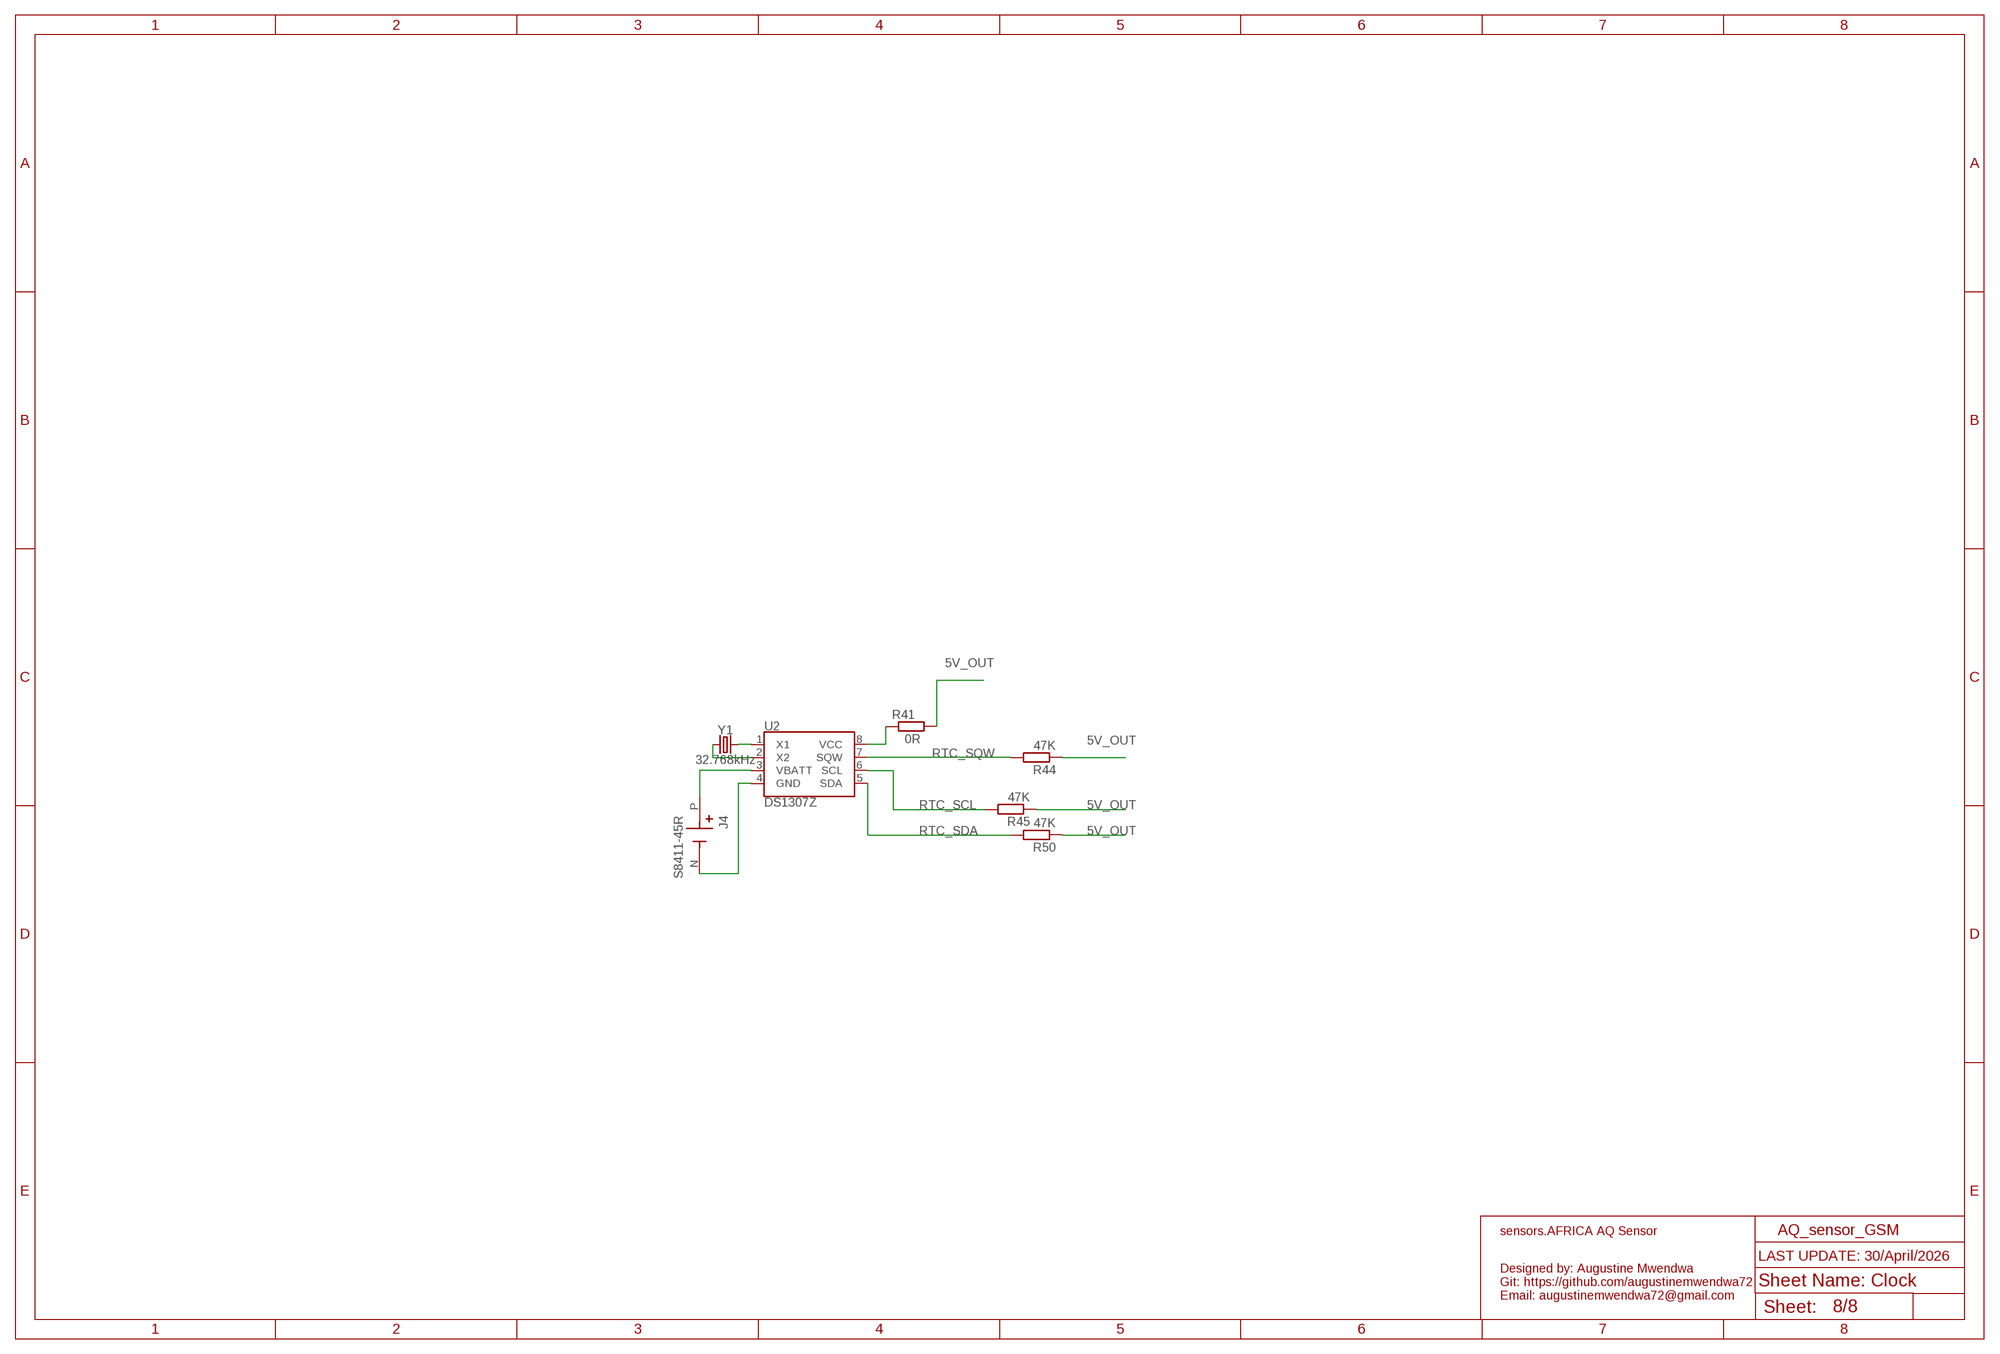
[diagram p7: schematic, sheet 8]

### Parts
J4  S8411-45R  [HARWIN_S8411-45R]
R41  0R  R-EU_R0603  [R0603]
R44  47K  R-EU_R0603  [R0603]
R45  47K  R-EU_R0603  [R0603]
R50  47K  R-EU_R0603  [R0603]
U2  DS1307Z  [SO08-0.15]
Y1  32.768kHz  CRYSTAL-32.768KHZSMD-3.2X1.5  [CRYSTAL-SMD-3.2X1.5MM]

### Nets
5V_OUT [HCurrent]: R41.2 R44.1 R45.1 R50.1 ; also sheet 1,3,4,6
N$50: U2.1(X1) Y1.P$2
N$51: U2.2(X2) Y1.P$1
N$58: J4.P(+) U2.3(VBATT)
N$59: J4.N(-) U2.4(GND)
N$63: R41.1 U2.8(VCC)
RTC_SCL: R45.2 U2.6(SCL) ; also sheet 1
RTC_SDA: R50.2 U2.5(SDA) ; also sheet 1
RTC_SQW: R44.2 U2.7(SQW) ; also sheet 1

### Notes on the sheet
- sensors.AFRICA AQ Sensor
- LAST UPDATE: 30/April/2026
- Sheet Name: Clock
- Designed by: Augustine Mwendwa
  Git: https://github.com/augustinemwendwa72
  Email: augustinemwendwa72@gmail.com

## Library data of the parts
3.3IND 5V_IN 5V_LED 12V_LED CHRG FULL MODE MRI NST PST = led:LED: LED OSRAM: - CHIPLED LG R971, LG N971, LY N971, LG Q971, LY Q971, LO R971, LY R971 LH N974, LH R974 LS Q976, LO Q976, LY Q976 LO Q996 - Hyper CHIPLED LW Q18S LB Q993, LB Q99A, LB R99A - SideLED LS A670, LO A670, LY A670, LG A670, LP A670 LB A673, LV A673, LT A673, LW A673 LH A674 LY A675 LS A676, LA A676, LO A676, LY A676, LW A676 LS A679, LY A679, LG A679 - Hyper Micro SIDELED® LS Y876, LA Y876, LO Y876, LY Y876 LT Y87S - SmartLED LW L88C, LW L88S LB L89C, LB L89S, LG L890 LS L89K, LO L89K, LY L89K LS L896, LA L896, LO L896, LY L896 - TOPLED LS T670, LO T670, LY T670, LG T670, LP T670 LSG T670, LSP T670, LSY T670, LOP T670, LYG T670 LG T671, LOG T671, LSG T671 LB T673, LV T673, LT T673, LW T673 LH T674 LS T676, LA T676, LO T676, LY T676, LB T676, LH T676, LSB T676, LW T676 LB T67C, LV T67C, LT T67C, LS T67K, LO T67K, LY T67K, LW E67C LS E67B, LA E67B, LO E67B, LY E67B, LB E67C, LV E67C, LT E67C LW T67C LS T679, LY T679, LG T679 LS T770, LO T770, LY T770, LG T770, LP T770 LB T773, LV T773, LT T773, LW T773 LH T774 LS E675, LA E675, LY E675, LS T675 LS T776, LA T776, LO T776, LY T776, LB T776 LHGB T686 LT T68C, LB T68C - Hyper Mini TOPLED® LB M676 - Mini TOPLED Santana® LG M470 LS M47K, LO M47K, LY M47K Source: http://www.osram.convergy.de LUXEON: - LUMILED® LXK2-PW12-R00, LXK2-PW12-S00, LXK2-PW14-U00, LXK2-PW14-V00 LXK2-PM12-R00, LXK2-PM12-S00, LXK2-PM14-U00 LXK2-PE12-Q00, LXK2-PE12-R00, LXK2-PE12-S00, LXK2-PE14-T00, LXK2-PE14-U00 LXK2-PB12-K00, LXK2-PB12-L00, LXK2-PB12-M00, LXK2-PB14-N00, LXK2-PB14-P00, LXK2-PB14-Q00 LXK2-PR12-L00, LXK2-PR12-M00, LXK2-PR14-Q00, LXK2-PR14-R00 LXK2-PD12-Q00, LXK2-PD12-R00, LXK2-PD12-S00 LXK2-PH12-R00, LXK2-PH12-S00 LXK2-PL12-P00, LXK2-PL12-Q00, LXK2-PL12-R00 Source: www.luxeon.com KINGBRIGHT: KA-3528ASYC Source: www.kingbright.com
3.7_JST 5V_JST 12V = Connector:2828XX-2: 2 Position Wire to Board Terminal Block Horizontal with Board; CATEGORY: Connectors; DATASHEET: https://www.te.com/usa-en/product-282834-2.datasheet.pdf; DESCRIPTION: 2 Position Wire to Board Terminal Block Horizontal with Board 0.100" (2.54mm) Through Hole; MANUFACTURER: TE Connectivity AMP Connectors; MPN: 282834-2; OPERATING_TEMPERATURE: -40°C ~ 105°C; PACKAGE_SIZE: NA; PACKAGE_TYPE: Through Hole; PART_STATUS: Active; PITCH: 0.100" (2.54mm); ROHS: Compliant; SERIES: Buchanan; SUBCATEGORY: Terminal Blocks; TYPE: Screw Terminal - Rising Cage Clamp Side Wire Entry
5V_REG_1 = LM7805MPX_NOPB:LM7805MPX/NOPB: 1.5-A, 30-V, linear voltage regulator 4-SOT-223 0 to 125 Check availability <https://pricing.snapeda.com/parts/LM7805MPX/NOPB/Texas%20Instruments/view-part?ref=eda>; AVAILABILITY: In Stock; CHECK_PRICES: https://www.snapeda.com/parts/LM7805MPX/NOPB/Texas+Instruments/view-part/?ref=eda; DESCRIPTION: 1.5-A, 30-V, linear voltage regulator; MF: Texas Instruments; MP: LM7805MPX/NOPB; PACKAGE: SOT-223-4 Texas Instruments; PRICE: None; PURCHASE-URL: https://www.snapeda.com/api/url_track_click_mouser/?unipart_id=546225&manufacturer=Texas Instruments&part_name=LM7805MPX/NOPB&search_term= lm7805mpx; SNAPEDA_LINK: https://www.snapeda.com/parts/LM7805MPX/NOPB/Texas+Instruments/view-part/?ref=snap
AE1 = W3011:W3011: Check availability <https://pricing.snapeda.com/parts/W3011/PulseLarsen%20Antennas/view-part?ref=eda>; AVAILABILITY: In Stock; CHECK_PRICES: https://www.snapeda.com/parts/W3011/PulseLarsen+Antennas/view-part/?ref=eda; DESCRIPTION: 1.561GHz, 1.5755GHz, 1.602GHz Beidou, Galileo, GLONASS, GNSS, GPS Chip RF Antenna 1.559GHz ~ 1.563GHz, 1.574GHz ~ 1.576GHz, 1.598GHz ~ 1.606GHz 1.3dBi, 2dBi, 2.2dBi Solder Surface Mount; MF: PulseLarsen Antennas; MP: W3011; PACKAGE: 0201 PulseLarsen Antennas; PRICE: None; SNAPEDA_LINK: https://www.snapeda.com/parts/W3011/PulseLarsen+Antennas/view-part/?ref=snap
BT_ANT LORA = SparkFun-Connectors:CONN_01: Single connection point. Often used as Generic Header-pin footprint for 0.1 inch spaced/style header connections On any of the 0.1 inch spaced packages, you can populate with these: Break Away Headers - Straight <https://www.sparkfun.com/products/116> (PRT-00116) Break Away Male Headers - Right Angle <https://www.sparkfun.com/products/553> (PRT-00553) Female Headers <https://www.sparkfun.com/products/115> (PRT-00115) Break Away Headers - Machine Pin <https://www.sparkfun.com/products/117> (PRT-00117) Break Away Female Headers - Swiss Machine Pin <https://www.sparkfun.com/products/743> (PRT-00743) This device is also useful as a general connection point to wire up your design to another part of your project. Our various solder wires solder well into these plated through hole pads. Hook-Up Wire - Assortment (Stranded, 22 AWG) <https://www.sparkfun.com/products/11375> (PRT-11375) Hook-Up Wire - Assortment (Solid Core, 22 AWG) <https://www.sparkfun.com/products/11367> (PRT-11367) View the entire wire category on our website here <https://www.sparkfun.com/categories/141> Special notes: SMTSO-256-ET is a "flush mount" nut for a 4-40 screw. We mostly use this on specialty testbeds; it is a nice way to connect hardware to your PCB at an adjustable hieght. Also note, the SNAP packages are for using a snappable style connector. We sell a baggie of snaps and they are also used on two LilyPad designs: Snap Assortment - 30 pack (male and female) <https://www.sparkfun.com/products/11347> (DEV-11347) LilyPad Arduino SimpleSnap <https://www.sparkfun.com/products/10941> (DEV-10941) LilyPad SimpleSnap Protoboard <https://www.sparkfun.com/products/10940> (DEV-10940)
C1 = SparkFun-Capacitors:10NF: 0.01uF/10nF/10,000pF ceramic capacitors A capacitor is a passive two-terminal electrical component used to store electrical energy temporarily in an electric field. CAP-09321; PROD_ID: CAP-00867
C2 C6 = 20TQC100MYF:20TQC100MYF: Check availability <https://pricing.snapeda.com/parts/20TQC100MYF/Panasonic%20Electronic/view-part?ref=eda>; AVAILABILITY: In Stock; CHECK_PRICES: https://www.snapeda.com/parts/20TQC100MYF/Panasonic+Electronic+Components/view-part/?ref=eda; DESCRIPTION: 100 µF Molded Tantalum Polymer Capacitor 20 V 2917 (7343 Metric) 55mOhm @ 100kHz; MF: Panasonic Electronic; MP: 20TQC100MYF; PACKAGE: 7343-2 Panasonic; PRICE: None; SNAPEDA_LINK: https://www.snapeda.com/parts/20TQC100MYF/Panasonic+Electronic+Components/view-part/?ref=snap
C3 C39-C43 = SparkFun-Capacitors:100PF: 100pF/0.1nF ceramic capacitors A capacitor is a passive two-terminal electrical component used to store electrical energy temporarily in an electric field.; PROD_ID: CAP-07883
C4 C5 C13 C14 C18-C20 = 06035C104K4T2A:06035C104K4T2A: Capacitor MLCC 0603 100nF 50V Check availability <https://pricing.snapeda.com/parts/06035C104K4T2A/AVX/view-part?ref=eda>; AVAILABILITY: In Stock; CHECK_PRICES: https://www.snapeda.com/parts/06035C104K4T2A/AVX+%252F+Kyocera/view-part/?ref=eda; DESCRIPTION: Capacitor MLCC 0603 100nF 50V | AVX 06035C104K4T2A; MF: AVX; MP: 06035C104K4T2A; PACKAGE: 1608 AVX; PRICE: None; SNAPEDA_LINK: https://www.snapeda.com/parts/06035C104K4T2A/AVX+%252F+Kyocera/view-part/?ref=snap
C7 C8 C22 C25-C27 C32 = Resistor_Capacitor:TAJB106K016RNJ: CAP TANT 10UF 10% 16V 1411 Manufacturer's datasheet <http://datasheets.avx.com/TAJ.pdf>; CREATED_BY: PCBLayout.com; DIGIKEY_PART_NUMBER: 478-1673-2-ND; MANUFACTURER: AVX Corporation; MPN: TAJB106K016RNJ; PACKAGE: CAP TANT B
C9-C12 C15-C17 C21 C23 C24 C28-C31 C33-C38 = rcl:C-EU: CAPACITOR, European symbol; SPICEPREFIX: C
D1 D4 D5 D7-D12 = noise_monitor:ON_SEMI_1N4148WS: Small Signal Diodes; CENTROID_NOT_SPECIFIED: No; DATASHEET: https://www.fairchildsemi.com/datasheets/1N/1N4148WS.pdf; DIGIKEY_DESCRIPTION: DIODE GEN PURP 75V 150MA SOD323F; DIGIKEY_PART_NUMBER: 1N4148WSFSCT-ND; IPC_LAND_PATTERN_NAME: SOD250125X70-2; LEAD_FREE: yes; MF: ON Semi; MFG_PACKAGE_IDENT: CASE 477AB; MOUSER_DESCRIPTION: Diodes - General Purpose, Power, Switching Small Signal Diode; MOUSER_PART_NUMBER: 512-1N4148WS; MPN: 1N4148WS; PACKAGE: SOD-323FL; PREFIX: D; ROHS: yes; TEMPERATURE_RANGE_HIGH: +150°C
D2 = AQ_sensor_GSM:ON_SEMICONDUCTOR_MMSZ5231BT1G: ONSC-K1A2-2; CIIVA_IDS: 804101; COMPONENT_LINK_1_DESCRIPTION: Manufacturer URL; COMPONENT_LINK_1_URL: http://www.onsemi.com/; COMPONENT_LINK_3_DESCRIPTION: Package Specification; COMPONENT_LINK_3_URL: http://www.onsemi.com/pub_link/Collateral/425-04.PDF; DATASHEET: http://www.onsemi.com/pub_link/Collateral/MMSZ5221BT1-D.PDF; DATASHEET_VERSION: Rev. 12; FOOTPRINT_VARIANT_NAME_0: Manufacturer Recommended; IMPORTED: yes; IMPORTED_FROM: vault; IMPORT_TS: 1521844429; MF: On Semiconductor; MOUNTING_TECHNOLOGY: Surface Mount; MPN: MMSZ5231BT1G; PACKAGE: SOD-123-2-425-04; PACKAGE_DESCRIPTION: 2-Pin SOD, Body 1.6 x 2.69 mm; PACKAGE_VERSION: Rev. G, 10/2009; PACKING: Tape and Reel; PREFIX: D; P_MAX_W: 0.5; RELEASE_DATE: 1407150685; ROHS: No; VAULT_GUID: 27F6BF34-1EB2-4973-A1B4-1410F52D084D; VAULT_REVISION: BBBB861B-93F7-43FE-93E6-D586C34E6C45; VZ_TYP_V: 5.1
D3 = AQ_sensor_GSM:SEMTECH_SMF05C: TVS Diode Array; CENTROID_NOT_SPECIFIED: No; DATASHEET: http://www.semtech.com/images/datasheet/smf05c.pdf; DIGIKEY_DESCRIPTION: DIODE TVS DIODE 5VWM 12.5VC SC70-6; DIGIKEY_PART_NUMBER: SMF05CCT-ND; JUNCTION_CAPACITANCE: 130pF max; LEAD_FREE: yes; MANUFACTURER_PRODUCT_PAGE: http://www.semtech.com/apps/product.php?pn=SMF05C; MF: Semtech; MFG_PACKAGE_IDENT: SC70-6L; MOUSER_PART_NUMBER: 947-SMF05C.TCT; MPN: SMF05C; PACKAGE: SC-70-6; PREFIX: D; REVERSE_STAND-OFF_VOLTAGE: 5V; ROHS: yes; TEMPERATURE_RANGE_HIGH: +125°C; TEMPERATURE_RANGE_LOW: -55°C
D6 = SS54-HF schottkey Diode:SS54-HF: DIODE SCHOTTKY 5A 40V SMA Source: Datasheet <https://componentsearchengine.com/Datasheets/1/SS54-HF.pdf> Check availability <https://pricing.snapeda.com/parts/SS54-HF/Comchip%20Technology/view-part?ref=eda>; AVAILABILITY: In Stock; CHECK_PRICES: https://www.snapeda.com/parts/SS54-HF/Comchip+Technology/view-part/?ref=eda; DESCRIPTION: Diode Schottky 40 V 5A Surface Mount DO-214AC (SMA); MF: Comchip Technology; MP: SS54-HF; PACKAGE: DO-214AC-214 Comchip Technology; PRICE: None; PURCHASE-URL: https://www.snapeda.com/api/url_track_click_mouser/?unipart_id=5812679&manufacturer=Comchip Technology&part_name=SS54-HF&search_term=ss54; SNAPEDA_LINK: https://www.snapeda.com/parts/SS54-HF/Comchip+Technology/view-part/?ref=snap
DW01 = DW01-P:DW01-P: Check availability <https://pricing.snapeda.com/parts/DW01-P/Fortune/view-part?ref=eda>; AVAILABILITY: In Stock; CHECK_PRICES: https://www.snapeda.com/parts/DW01-P/Fortune+Semiconductor/view-part/?ref=eda; DESCRIPTION: One Cell Lithium-ion/Polymer Battery Protection IC; MF: Fortune; MP: DW01-P; PACKAGE: None; PRICE: None; SNAPEDA_LINK: https://www.snapeda.com/parts/DW01-P/Fortune+Semiconductor/view-part/?ref=snap
EC200_GSM = EC200UCNAB-N05-SNNSA:EC200UCNAB-N05-SNNSA: Check availability <https://pricing.snapeda.com/parts/EC200UCNAB-N05-SNNSA/Quectel/view-part?ref=eda>; AVAILABILITY: In Stock; CHECK_PRICES: https://www.snapeda.com/parts/EC200UCNAB-N05-SNNSA/Quectel/view-part/?ref=eda; DESCRIPTION: Quectel Wireless Solutions External Passive, 1559-1606, GNSS L1, Spiral, -, SMA Male (center pin), Terminal, 50 oe10; MF: Quectel; MP: EC200UCNAB-N05-SNNSA; PACKAGE: None; PRICE: None; SNAPEDA_LINK: https://www.snapeda.com/parts/EC200UCNAB-N05-SNNSA/Quectel/view-part/?ref=snap
ESP_UART POWER QUEC_C = AQ_sensor_GSM:10118192-0001LF: Single Port 5 Contact Horizontal Right Angle Shielded Micro B USB 2.0 Connector; AVAILABILITY: Unavailable; DESCRIPTION: USB - micro B USB 2.0 Receptacle Connector 5 Position Surface Mount, Right Angle; MF: Amphenol ICC; MP: 10118192-0001LF; PACKAGE: None; PRICE: None
FLASH RESET = noise_monitor:KMR621NGLFS: Tactile Switches 50mA 32VDC 1.9mmH 2N IP67; AVAILABILITY: Unavailable; DESCRIPTION: Tactile Switch SPST-NO Top Actuated Surface Mount; MF: C&K; MP: KMR621NG LFS; PACKAGE: None; PRICE: None
GBOOT GRST = AQ_sensor_GSM:ON_SEMI_1N4148WS: Small Signal Diodes; CENTROID_NOT_SPECIFIED: No; DATASHEET: https://www.fairchildsemi.com/datasheets/1N/1N4148WS.pdf; DIGIKEY_DESCRIPTION: DIODE GEN PURP 75V 150MA SOD323F; DIGIKEY_PART_NUMBER: 1N4148WSFSCT-ND; IPC_LAND_PATTERN_NAME: SOD250125X70-2; LEAD_FREE: yes; MF: ON Semi; MFG_PACKAGE_IDENT: CASE 477AB; MOUSER_DESCRIPTION: Diodes - General Purpose, Power, Switching Small Signal Diode; MOUSER_PART_NUMBER: 512-1N4148WS; MPN: 1N4148WS; PACKAGE: SOD-323FL; PREFIX: D; ROHS: yes; TEMPERATURE_RANGE_HIGH: +150°C
GPS GSM = 1909763-1:1909763-1: VAO ITEM, MINI RF HEADER Check availability <https://pricing.snapeda.com/parts/1909763-1/TE%20Connectivity/view-part?ref=eda>; AVAILABILITY: In Stock; CHECK_PRICES: https://www.snapeda.com/parts/1909763-1/TE+Connectivity+AMP+Connectors/view-part/?ref=eda; COMMENT: 1909763-1; DESCRIPTION: U.FL (UMCC) Connector Jack, Male Pin 50 Ohms Surface Mount Solder; MF: TE Connectivity; MP: 1909763-1; PACKAGE: None; PRICE: None; SNAPEDA_LINK: https://www.snapeda.com/parts/1909763-1/TE+Connectivity+AMP+Connectors/view-part/?ref=snap
GSM_EXP J2 = 53261-0871:53261-0871: Connector Header Surface Mount, Right Angle 8 position 0.049" (1.25mm) Check availability <https://pricing.snapeda.com/parts/53261-0871/Molex/view-part?ref=eda>; AVAILABILITY: In Stock; CHECK_PRICES: https://www.snapeda.com/parts/53261-0871/Molex/view-part/?ref=eda; DESCRIPTION: Conn; Rect/PCB; Header; 1.25mm Pitch; W2B; 8 Pos; PicoBlade; SMT; Rt Ang; Tin | Molex Incorporated 53261-0871; MF: Molex; MP: 53261-0871; PACKAGE: None; PRICE: None; SNAPEDA_LINK: https://www.snapeda.com/parts/53261-0871/Molex/view-part/?ref=snap
GSM_RST = AQ_sensor_GSM:KMR621NGLFS: Tactile Switches 50mA 32VDC 1.9mmH 2N IP67; AVAILABILITY: Unavailable; DESCRIPTION: Tactile Switch SPST-NO Top Actuated Surface Mount; MF: C&K; MP: KMR621NG LFS; PACKAGE: None; PRICE: None
H1-H4 = AQ_sensor_GSM:MOUNT-PAD-ROUND: MOUNTING PAD, round
J1 = AQ_sensor_GSM:F-1X03-: FEMALE HEADER
J3 = DS1021-1X2SF162-B:DS1021-1X2SF162-B: Check availability <https://pricing.snapeda.com/parts/DS1021-1X2SF162-B/Connfly/view-part?ref=eda>; AVAILABILITY: In Stock; CHECK_PRICES: https://www.snapeda.com/parts/DS1021-1X2SF162-B/Connfly/view-part/?ref=eda; DESCRIPTION: Pin header; pin strips; male; PIN: 2; straight; 2.54mm; THT; 1x2; MF: Connfly; MP: DS1021-1X2SF162-B; PACKAGE: None; PRICE: None; SNAPEDA_LINK: https://www.snapeda.com/parts/DS1021-1X2SF162-B/Connfly/view-part/?ref=snap
J4 = S8411-45R:S8411-45R: Check availability <https://pricing.snapeda.com/parts/S8411-45R/Harwin/view-part?ref=eda>; AVAILABILITY: In Stock; CHECK_PRICES: https://www.snapeda.com/parts/S8411-45R/Harwin+Inc./view-part/?ref=eda; DESCRIPTION: Coin Cell Battery Retainer, Horizontal SMT, for CR1220 Coin Cell Batteries, Tape & Reeled; MF: Harwin; MP: S8411-45R; PACKAGE: None; PRICE: None; SNAPEDA_LINK: https://www.snapeda.com/parts/S8411-45R/Harwin+Inc./view-part/?ref=snap
JP1 = Connector:PINHD-1X4: Pin Header; CATEGORY_L1: Connectors; CATEGORY_L2: Headers; CATEGORY_L3: Male Pins; DESCRIPTION: Header-Straight-4 Position; PACKAGE: Through Hole; PITCH: 0.100" (2.54mm)
JTAG = USB4105GFA120:USB4105GFA120: Check availability <https://pricing.snapeda.com/parts/USB4105GFA120/Global%20Connector%20Technology/view-part?ref=eda>; AVAILABILITY: In Stock; CHECK_PRICES: https://www.snapeda.com/parts/USB4105GFA120/Global+Connector+Technology/view-part/?ref=eda; DESCRIPTION: USB CONN, 2.0 TYPE C, RCPT, 16POS, SMT; USB Connector Type:USB Type C; USB Standard:USB 2.0; Gender:Receptacle; No. of Positions:16Positions; Connector Mounting:Surface Mount, Through Hole Mount; Orientation:Right Angle RoHS Compliant: Yes; MF: Global Connector Technology; MP: USB4105GFA120; PACKAGE: None; PRICE: None; SNAPEDA_LINK: https://www.snapeda.com/parts/USB4105GFA120/Global+Connector+Technology/view-part/?ref=snap
JUMP4V JUMP5V JUMPVL JUMPVL1.8 R4 R11 R16 R40 R52 R69 R70 = Resistor_Capacitor:CRCW08050000Z0EA: RES SMD 0 OHM JUMPER 1/8W 0805 Manufacturer's datasheet <http://www.vishay.com/docs/20035/dcrcwe3.pdf>; CREATED_BY: PCBLayout.com; DIGIKEY_PART_NUMBER: 541-0.0ATR-ND; MANUFACTURER: Vishay Dale; MPN: CRCW08050000Z0EA; PACKAGE: SMD 0805
L1 L7-L9 = LQW15AN47NG00D 47uh:LQW15AN47NG00D: Inductor SMD 0402 47nH Check availability <https://pricing.snapeda.com/parts/LQW15AN47NG00D/Murata/view-part?ref=eda>; AVAILABILITY: In Stock; CHECK_PRICES: https://www.snapeda.com/parts/LQW15AN47NG00D/Murata+Electronics+North+America/view-part/?ref=eda; DESCRIPTION: Inductor with Inductance: 47nH Tol. +/-2%, Package: 0402 (1005); MF: Murata; MP: LQW15AN47NG00D; PACKAGE: 1005 Murata; PRICE: None; PURCHASE-URL: https://www.snapeda.com/api/url_track_click_mouser/?unipart_id=1499500&manufacturer=Murata&part_name=LQW15AN47NG00D&search_term=lqw15an47ng00d; SNAPEDA_LINK: https://www.snapeda.com/parts/LQW15AN47NG00D/Murata+Electronics+North+America/view-part/?ref=snap
L2-L4 = Fixed Inductors:784778010: FIXED IND 1UH 3.5A 36 MOHM SMD Manufacturer's datasheet <https://katalog.we-online.de/pbs/datasheet/784778010.pdf>; CREATED_BY: PCBLayout.com; DIGIKEY_PART_NUMBER: 732-6740-2-ND; MANUFACTURER: Wurth Electronics Inc.; MPN: 784778010; PACKAGE: 7332
L5 L6 = LXES15AAA1:LXES15AAA1-153: Check availability <https://pricing.snapeda.com/parts/LXES15AAA1-153/Murata/view-part?ref=eda>; AVAILABILITY: In Stock; CHECK_PRICES: https://www.snapeda.com/parts/LXES15AAA1-153/Murata/view-part/?ref=eda; DESCRIPTION: - Clamp - Ipp Tvs Diode Surface Mount 1005; MF: Murata; MP: LXES15AAA1-153; PACKAGE: 0402 Murata; PRICE: None; SNAPEDA_LINK: https://www.snapeda.com/parts/LXES15AAA1-153/Murata/view-part/?ref=snap
MICRO_SD1 = TF-01A:TF-01A: Connector - Card Sockets 8 1.1mm SMD RoHS Source: Datasheet <https://datasheet.lcsc.com/szlcsc/1903221101_Korean-Hroparts-Elec-TF-01A_C91145.pdf> Check availability <https://pricing.snapeda.com/parts/TF-01A/HRO%20Electronics%20Co.%2C%20Ltd./view-part?ref=eda> Check availability <https://pricing.snapeda.com/parts/TF-01A/HRO%20Electronics%20Co.%2C%20Ltd./view-part?ref=eda> Check availability <https://pricing.snapeda.com/parts/TF-01A/HRO%20Electronics%20Co.%2C%20Ltd./view-part?ref=eda>; AVAILABILITY: Not in stock; CHECK_PRICES: https://www.snapeda.com/parts/TF-01A/HRO+Electronics+Co.%252C+Ltd./view-part/?ref=eda; DESCRIPTION: Standard Card Edge Connectors; MF: HRO Electronics Co., Ltd.; MP: TF-01A; PACKAGE: Package; PRICE: None; SNAPEDA_LINK: https://www.snapeda.com/parts/TF-01A/HRO+Electronics+Co.%252C+Ltd./view-part/?ref=snap
POWER1 = AQ_sensor_GSM:PCM12SMTR: Switch Slide ON ON SPDT Side Slide 0.3A 6VDC 10000Cycles Gull Wing SMD T/R; AVAILABILITY: Unavailable; DESCRIPTION: Slide Switch SPDT Surface Mount, Right Angle; MF: C&K; MP: PCM12SMTR; PACKAGE: DO-201 C&amp;K Components; PRICE: None
Q2-Q7 = MMBT2222_:MMBT2222*: NPN Transistor Check availability <https://pricing.snapeda.com/parts/MMBT2222/ON%20Semiconductor/view-part?ref=eda>; AVAILABILITY: In Stock; CHECK_PRICES: https://www.snapeda.com/parts/MMBT2222/Onsemi/view-part/?ref=eda; DESCRIPTION: Bipolar (BJT) Transistor NPN 30 V 600 mA 250MHz 300 mW Surface Mount SOT-23-3 (TO-236); MF: ON Semiconductor; MP: MMBT2222; PACKAGE: SOT-23-3 Fairchild Semiconductor; PRICE: None; SNAPEDA_LINK: https://www.snapeda.com/parts/MMBT2222/Onsemi/view-part/?ref=snap
Q8 = FS8205:FS8205: Dual N Channel Enhancement Mode Power MOSFET Check availability <https://pricing.snapeda.com/parts/FS8205/Fortune%20Semiconductor/view-part?ref=eda>; AVAILABILITY: In Stock; CHECK_PRICES: https://www.snapeda.com/parts/FS8205/Fortune+Semiconductor/view-part/?ref=eda; DESCRIPTION: Dual N-Channel Enhancement Mode Power MOSFET; MF: Fortune Semiconductor; MP: FS8205; PACKAGE: Package; PRICE: None; SNAPEDA_LINK: https://www.snapeda.com/parts/FS8205/Fortune+Semiconductor/view-part/?ref=snap
R1 R5-R7 R12-R15 R18 R21-R36 R38 R39 R41-R51 R66-R68 R71-R76 R500-R502 = rcl:R-EU_: RESISTOR, European symbol; SPICEPREFIX: R
R2 R3 R8-R10 = SparkFun-Resistors:1.20KOHM: 1.20kΩ resistor A resistor is a passive two-terminal electrical component that implements electrical resistance as a circuit element. Resistors act to reduce current flow, and, at the same time, act to lower voltage levels within circuits. - Wikipedia; PROD_ID: RES-08413
R17 R19 R20 R37 R53-R65 = SparkFun-Resistors:1.20KOHM: 1.20kΩ resistor A resistor is a passive two-terminal electrical component that implements electrical resistance as a circuit element. Resistors act to reduce current flow, and, at the same time, act to lower voltage levels within circuits. - Wikipedia; PROD_ID: RES-08413; VALUE: 1.20k
RST2 = SKRTLAE010:SKRTLAE010: Check availability <https://pricing.snapeda.com/parts/SKRTLAE010/ALPS/view-part?ref=eda>; AVAILABILITY: In Stock; CHECK_PRICES: https://www.snapeda.com/parts/SKRTLAE010/ALPS/view-part/?ref=eda; DESCRIPTION: Switch Tactile N.O. SPST Round Button J-Bend 0.05A 12VDC 1.6N SMD Embossed Tape; MF: ALPS; MP: SKRTLAE010; PACKAGE: None; PRICE: None; SNAPEDA_LINK: https://www.snapeda.com/parts/SKRTLAE010/ALPS/view-part/?ref=snap
SIMCARD = 78646-3001:78646-3001: Conn Micro SIM Card SKT 6 POS 2.54mm Solder RA SMD 0.5A/Contact Embossed T/R Check availability <https://pricing.snapeda.com/parts/78646-3001/Molex/view-part?ref=eda>; AVAILABILITY: In Stock; CHECK_PRICES: https://www.snapeda.com/parts/78646-3001/Molex/view-part/?ref=eda; DESCRIPTION: Horizontal Surface Mount Micro SIM Card Connector, with Push In Termination | Molex Incorporated 78646-3001; MF: Molex; MP: 78646-3001; PACKAGE: None; PRICE: None; PURCHASE-URL: https://www.snapeda.com/api/url_track_click_mouser/?unipart_id=75189&manufacturer=Molex&part_name=78646-3001&search_term= 786463001; SNAPEDA_LINK: https://www.snapeda.com/parts/78646-3001/Molex/view-part/?ref=snap
T1 T2 = noise_monitor:*-NPN-: NPN Transistror
U1 = noise_monitor:CP2102N-A02-GQFN28: Check availability <https://pricing.snapeda.com/parts/CP2102N-A02-GQFN28/Silicon%20Labs/view-part?ref=eda>; AVAILABILITY: In Stock; DESCRIPTION: USB Bridge, USB to UART USB 2.0 UART Interface 28-QFN (5x5); MF: Silicon Labs; MP: CP2102N-A02-GQFN28; PACKAGE: WFQFN-28 Silicon Labs; PRICE: None; PURCHASE-URL: https://pricing.snapeda.com/search/part/CP2102N-A02-GQFN28/?ref=eda
U2 = SparkFun-Clocks:DS1307: Maxim DS1307 - I2C Real-time clock (RTC) The DS1307 serial real-time clock (RTC) is a low-power, full binary-coded decimal (BCD) clock/calendar plus 56 bytes of NV SRAM. Address and data are transferred serially through an I2C, bidirectional bus. The clock/calendar provides seconds, minutes, hours, day, date, month, and year information. SparkFun Products: Real Time Clock Module <https://www.sparkfun.com/products/12708> (BOB-12708) Datasheet <https://cdn.sparkfun.com/datasheets/BreakoutBoards/DS1307.pdf>; PROD_ID: IC-08138
U3 = TP4056:TP4056: Check availability <https://pricing.snapeda.com/parts/TP4056/NanJing%20Top%20Power%20ASIC%20Corp./view-part?ref=eda>; AVAILABILITY: Not in stock; CHECK_PRICES: https://www.snapeda.com/parts/TP4056/NanJing+Top+Power+ASIC+Corp./view-part/?ref=eda; DESCRIPTION: Complete single cell Li-Ion battery with a constant current / constant voltage linear charger; MF: NanJing Top Power ASIC Corp.; MP: TP4056; PACKAGE: Package; PRICE: None; SNAPEDA_LINK: https://www.snapeda.com/parts/TP4056/NanJing+Top+Power+ASIC+Corp./view-part/?ref=snap
U4 U6 U7 = TPS63802DLAR:TPS63802DLAR: Check availability <https://pricing.snapeda.com/parts/TPS63802DLAR/Texas%20Instruments/view-part?ref=eda>; AVAILABILITY: In Stock; CHECK_PRICES: https://www.snapeda.com/parts/TPS63802DLAR/Texas+Instruments/view-part/?ref=eda; DESCRIPTION: 2-A, high-efficient, 11-µA quiescent current buck-boost converter in QFN/DFN package; MF: Texas Instruments; MP: TPS63802DLAR; PACKAGE: VSON-HR-10 Texas Instruments; PRICE: None; SNAPEDA_LINK: https://www.snapeda.com/parts/TPS63802DLAR/Texas+Instruments/view-part/?ref=snap
U5 = TXS0108EPWR:TXS0108EPWR: Check availability <https://pricing.snapeda.com/parts/TXS0108EPWR/Texas%20Instruments/view-part?ref=eda>; AVAILABILITY: In Stock; CHECK_PRICES: https://www.snapeda.com/parts/TXS0108EPWR/Texas+Instruments/view-part/?ref=eda; DESCRIPTION: 8-bit bidirectional voltage-level shifter for open-drain and push-pull application; MF: Texas Instruments; MP: TXS0108EPWR; PACKAGE: TSSOP-20 Texas Instruments; PRICE: None; PURCHASE-URL: https://www.snapeda.com/api/url_track_click_mouser/?unipart_id=105750&manufacturer=Texas Instruments&part_name=TXS0108EPWR&search_term=txs0108epwr; SNAPEDA_LINK: https://www.snapeda.com/parts/TXS0108EPWR/Texas+Instruments/view-part/?ref=snap
U8 = AMS1117-3.3:AMS1117-3.3: Check availability <https://pricing.snapeda.com/parts/AMS1117-3.3/Advanced%20Monolithic%20Systems/view-part?ref=eda>; AVAILABILITY: Not in stock; CHECK_PRICES: https://www.snapeda.com/parts/AMS1117-3.3/Advanced+Monolithic+Systems/view-part/?ref=eda; DESCRIPTION: Sot223/Pkg 1-Amp 3.3-Volt Low Drop Out Voltage Regulatator; MF: Advanced Monolithic Systems; MP: AMS1117-3.3; PACKAGE: SOT-223 Seeed Technology; PRICE: None; SNAPEDA_LINK: https://www.snapeda.com/parts/AMS1117-3.3/Advanced+Monolithic+Systems/view-part/?ref=snap
U9 = AMS1117-1.8:AMS1117-1.8: Check availability <https://pricing.snapeda.com/parts/AMS1117-1.8/Advanced%20Monolithic%20Systems/view-part?ref=eda>; AVAILABILITY: Not in stock; CHECK_PRICES: https://www.snapeda.com/parts/AMS1117-1.8/Advanced+Monolithic+Systems/view-part/?ref=eda; MF: Advanced Monolithic Systems; MP: AMS1117-1.8; PACKAGE: SOT-223 Seeed Technology; PRICE: None; SNAPEDA_LINK: https://www.snapeda.com/parts/AMS1117-1.8/Advanced+Monolithic+Systems/view-part/?ref=snap
U$2-U$75 U$81-U$85 U$87-U$106 U$108 U$112 = NC_MARKER:NC_MARKER
U$86 = SX1276SXS_N:SX1276SXS
U$107 = GSM_SPRING_ANTENNA:GSM_SPRING_ANTENNA
U$109 = ADCH002_V1:ADCH002_V1
X1 = ESP32-S3-WROOM-1-N16R8:ESP32-S3-WROOM-1-N16R8: 2.4 GHz Wi-Fi (802.11 b/g/n) and Bluetooth® 5 (LE) module Built around ESP32-S3 series of SoCs, Xtensa® dual-core 32-bit LX7 microprocessor Flash up to 16 MB, PSRAM up to 8 MB 36 GPIOs, rich set of peripherals On-board PCB antenna Check availability <https://pricing.snapeda.com/parts/ESP32-S3-WROOM-1-N16R8/Espressif%20Systems/view-part?ref=eda>; AVAILABILITY: In Stock; CHECK_PRICES: https://www.snapeda.com/parts/ESP32-S3-WROOM-1-N16R8/Espressif+Systems/view-part/?ref=eda; DESCRIPTION: Bluetooth, WiFi 802.11b/g/n, Bluetooth v5.0 Transceiver Module 2.4GHz PCB Trace Surface Mount; MF: Espressif Systems; MP: ESP32-S3-WROOM-1-N16R8; PACKAGE: NON STANDARD Espressif Systems; PRICE: None; PURCHASE-URL: https://www.snapeda.com/api/url_track_click_mouser/?unipart_id=12089783&manufacturer=Espressif Systems&part_name=ESP32-S3-WROOM-1-N16R8&search_term=esp32-s3-wroom-1-n16r8; SNAPEDA_LINK: https://www.snapeda.com/parts/ESP32-S3-WROOM-1-N16R8/Espressif+Systems/view-part/?ref=snap
Y1 = SparkFun-Clocks:CRYSTAL-32.768KHZ: 32.768kHz Crystal Frequency: 32.768kHz Frequency Stability: ±20ppm Load Capacitance: 12.5pF (PTH-2X6 & SMD-3.2X1.5), 6pF (SMD-2X6) SparkFun Products: SparkFun BigTime Watch Kit <https://www.sparkfun.com/products/11734> SparkFun nRF52832 Breakout <https://www.sparkfun.com/products/13990> SparkFun Real Time Clock Module <https://www.sparkfun.com/products/12708>; PROD_ID: XTAL-13062

## Net classes
0 default: width 0.1 mm, drill 0.2 mm, clearance 0.1 mm
1 POWER: width 0.2 mm, drill 0.2 mm, clearance 0.2 mm to class 0, clearance 0.2 mm
2 BGA: width 0.1 mm, drill 0.2 mm
3 HCurrent: width 0.2 mm, drill 0.2 mm, clearance 0.2 mm to class 0
4 Antenna: width 0.3 mm, drill 0.2 mm, clearance 0.3 mm to class 0